# Altium project remote.PrjPCB (part 1 of 2)
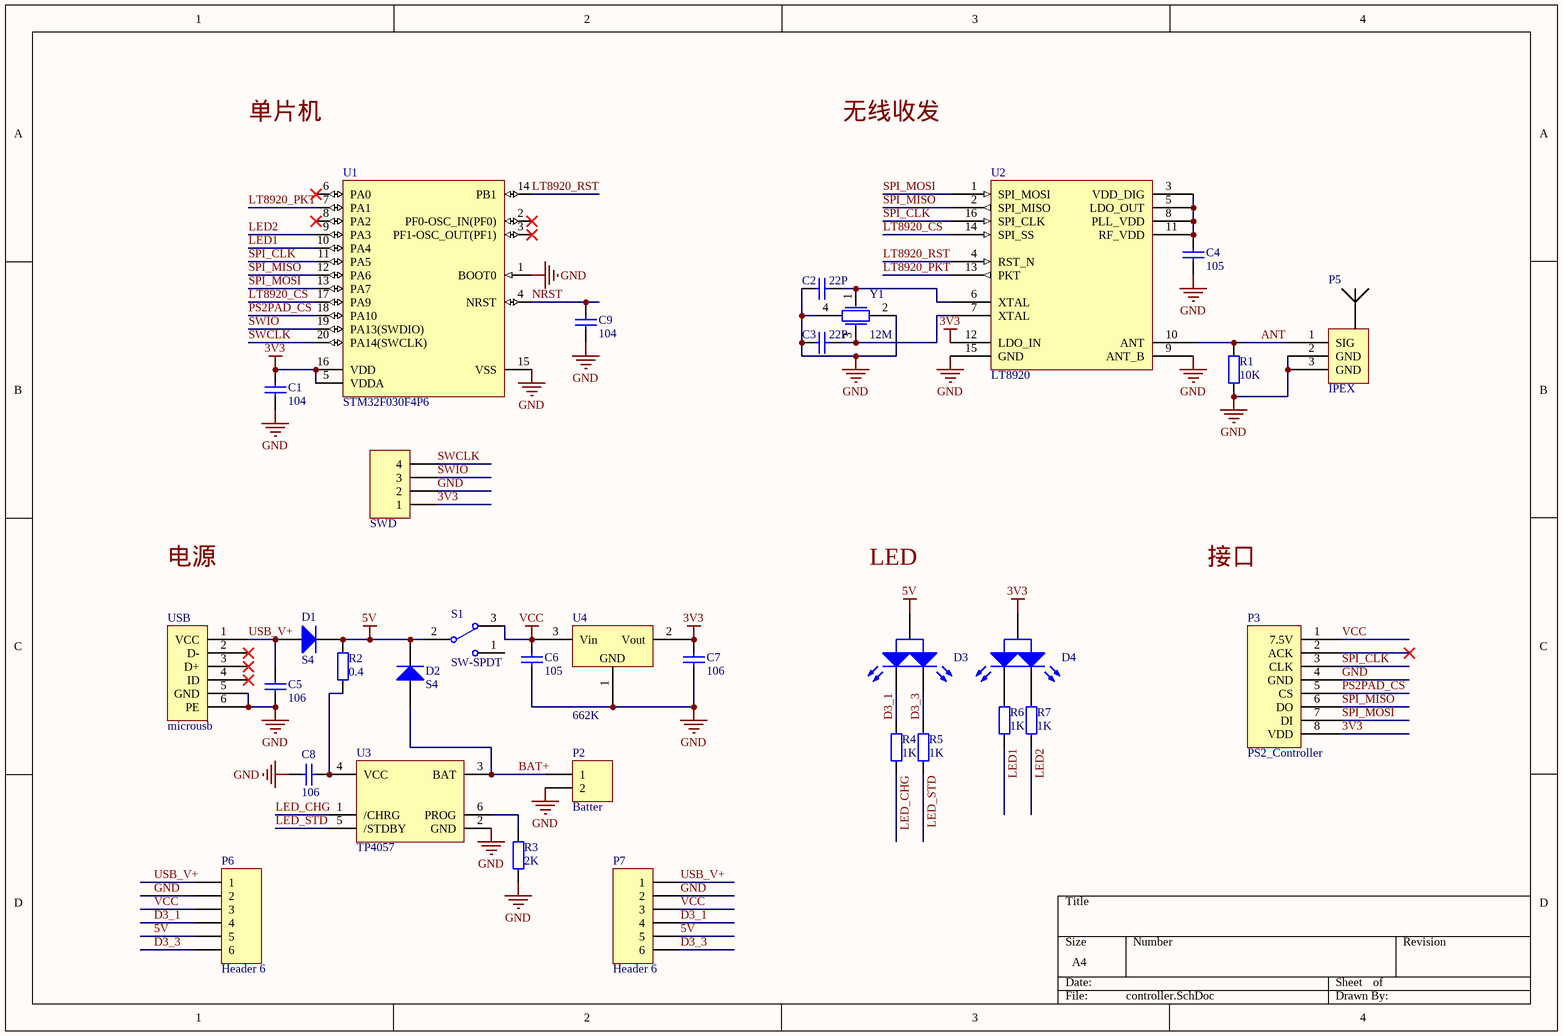
[diagram p0: controller.SchDoc]
9 sheets, 259 parts. Net scope: global (net labels, ports and power ports of the same name join across sheets).
Board files: controller.PcbDoc, controller_4layer.PcbDoc, receiver_plane_2S_A.PcbDoc, receiver_car_2S_A.PcbDoc
Sheets:
  controller.SchDoc
  controller-4layer.SchDoc
  controller_PA.SchDoc
  receiver_boat.SchDoc
  receiver_plane.SchDoc
  receiver_plane_2S.SchDoc
  receiver_car_2s.SchDoc
  receiver_car_1s.SchDoc
  receiver_car_2S_A.SchDoc

## Sheet controller.SchDoc
size A4

### Parts
(Parts that share a designator on the sheet are numbered #1, #2 ... from top to bottom, then left to right.)
C1#1  value 104  [0805-2]  (hidden comment: Cap)
C2#1  value 22P  [0805-2]  (hidden comment: Cap)
C3#1  value 22P  [0805-2]  (hidden comment: Cap)
C4#1  value 105  [0805-2]  (hidden comment: Cap)
C5#1  value 106  [0805-2]  (hidden comment: Cap)
C6#1  value 105  [0805-2]  (hidden comment: Cap)
C7#1  value 106  [0805-2]  (hidden comment: Cap)
C8#1  value 106  [0805-2]  (hidden comment: Cap)
C9#1  value 104  [0805-2]  (hidden comment: Cap)
D1#1  S4  [SOD523]
D2#1  S4  [SOD523]
D3#1  LED1  [HDR3X1_A]  (value not drawn)
D4#1  LED1  [HDR3X1_A]  (value not drawn)
P2#1  Batter  [HDR1X2]
P3#1  PS2_Controller  [HDR8X1_A]
P5#1  IPEX  [U.FL-R-SMT]
P6#1  Header 6  [HDR6*1*1.27]
P7#1  Header 6  [HDR6*1*1.27]
R1#1  value 10K  [0805-2]  (hidden comment: Res1)
R2#1  value 0.4  [1210]  (hidden comment: Res1)
R3#1  value 2K  [0805-2]  (hidden comment: Res1)
R4#1  value 1K  [0805-2]  (hidden comment: Res1)
R5#1  value 1K  [0805-2]  (hidden comment: Res1)
R6#1  value 1K  [0805-2]  (hidden comment: Res1)
R7#1  value 1K  [0805-2]  (hidden comment: Res1)
S1  SW-SPDT  [SWITCH_A4]
SWD#1  Header 4  [HDR4X1X1.27]  (value not drawn)
U1#1  STM32F030F4P6  [STM-TSSOP20_N]
U2#1  LT8920  [SSOP-16 LT8920]
U3#1  TP4057  [SOT23-6]
U4#1  662K  [SOT-23]
USB#1  microusb  [MICROUSB_1]
Y1#1  12M  [XTAL_3225]

### Nets
3V3: C1#1.1 C7#1.1 D4#1.2(A) P3#1.8(VDD) SWD#1.1 U1#1.5(VDDA) U1#1.16(VDD) U2#1.12(LDO_IN) U4#1.2(Vout)
5V: D1#1.2(K) D2#1.2(K) D3#1.2(A) P6#1.5 P7#1.5 R2#1.2 S1.2
BAT+: D2#1.1(A) P2#1.1 U3#1.3(BAT)
GND: C1#1.2 C2#1.1 C3#1.1 C4#1.1 C5#1.2 C6#1.2 C7#1.2 C8#1.2 C9#1.2 P2#1.2 P3#1.4(GND) P5#1.2(GND) P5#1.3(GND) P6#1.2 P7#1.2 R1#1.1 R3#1.1 SWD#1.2 U1#1.1(BOOT0) U1#1.15(VSS) U2#1.9(ANT_B) U2#1.15(GND) U3#1.2(GND) U4#1.1(Vss) USB#1.5(GND) USB#1.6(PE) Y1#1.2 Y1#1.4
VCC: C6#1.1 P3#1.1(7.5V) P6#1.3 P7#1.3 S1.3 U4#1.3(Vin)
ANT: P5#1.1(SIG) R1#1.2 U2#1.10(ANT)
D3_1: D3#1.3(K2) P6#1.4 P7#1.4 R4#1.2
D3_3: D3#1.1(K1) P6#1.6 P7#1.6 R5#1.2
LED1: R6#1.1 U1#1.10(PA4)
LED2: R7#1.1 U1#1.9(PA3)
LED_CHG: R4#1.1 U3#1.1(/CHRG)
LED_STD: R5#1.1 U3#1.5(/STDBY)
LT8920_CS: U1#1.17(PA9) U2#1.14(SPI_SS)
LT8920_PKT: U1#1.7(PA1) U2#1.13(PKT)
LT8920_RST: U1#1.14(PB1) U2#1.4(RST_N)
NRST: C9#1.1 U1#1.4(NRST)
PS2PAD_CS: P3#1.5(CS) U1#1.18(PA10)
SPI_CLK: P3#1.3(CLK) U1#1.11(PA5) U2#1.16(SPI_CLK)
SPI_MISO: P3#1.6(DO) U1#1.12(PA6) U2#1.2(SPI_MISO)
SPI_MOSI: P3#1.7(DI) U1#1.13(PA7) U2#1.1(SPI_MOSI)
SWCLK: SWD#1.4 U1#1.20(PA14(SWCLK))
SWIO: SWD#1.3 U1#1.19(PA13(SWDIO))
USB_V+: C5#1.1 D1#1.1(A) P6#1.1 P7#1.1 USB#1.1(VCC)
NetC2#1_2: C2#1.2 U2#1.6(XTAL) Y1#1.1
NetC3#1_2: C3#1.2 U2#1.7(XTAL) Y1#1.3
NetC4#1_2: C4#1.2 U2#1.3(VDD_DIG) U2#1.5(LDO_OUT) U2#1.8(PLL_VDD) U2#1.11(RF_VDD)
NetC8#1_1: C8#1.1 R2#1.1 U3#1.4(VCC)
NetD4#1_1: D4#1.1(K1) R7#1.2
NetD4#1_3: D4#1.3(K2) R6#1.2
NetR3#1_2: R3#1.2 U3#1.6(PROG)

Not connected (* = marked no-connect by the designer): P3#1 2(ACK)*; S1 1; U1#1 2(PF0-OSC_IN(PF0))* 3(PF1-OSC_OUT(PF1))* 6(PA0)* 8(PA2)*; USB#1 2(D-)* 3(D+)* 4(ID)*

### Notes on the sheet
- 单片机
- 无线收发
- 电源
- LED
- 接口
- (in symbol 662K) GND

### Library data of the parts
C1#1 C2#1 C3#1 C4#1 C5#1 C6#1 C7#1 C8#1 C9#1 = Cap: 无极性电容; Published: 8-Jun-2000; LatestRevisionDate: 17-Jul-2002; LatestRevisionNote: Re-released for DXP Platform.; PackageReference: RAD-0.3; Publisher: Altium Limited
D1#1 D2#1 = Diode: Default Diode; Published: 8-Jun-2000; LatestRevisionDate: 17-Jul-2002; LatestRevisionNote: Re-released for DXP Platform.; PackageVersion: Sep-1996; PackageReference: SMC; Publisher: Altium Limited; PackageDescription: DO-214-AB/SMC; 2 C-Bend Leads; Body 7.9 x 5.9 mm, inc. leads (LxW); Code_JEDEC: DO-214-AB
D3#1 D4#1 = LED1: 双色LED; Published: 8-Jun-2000; LatestRevisionDate: 08-Jul-2005; LatestRevisionNote: Mech Layer 1 removed.; PackageReference: LED-0; Publisher: Altium Limited
P2#1 = Header 2: Header, 2-Pin; LatestRevisionDate: 17-Jul-2002; LatestRevisionNote: Re-released for DXP Platform.; Publisher: Altium Limited
P5#1 = IPEX: U.FL-R-SMT
P6#1 P7#1 = Header 6: 接插件; LatestRevisionDate: 17-Jul-2002; LatestRevisionNote: Re-released for DXP Platform.; Publisher: Altium Limited
R1#1 R2#1 R3#1 R4#1 R5#1 R6#1 R7#1 = Res1: 贴片电阻; Published: 8-Jun-2000; LatestRevisionDate: 17-Jul-2002; LatestRevisionNote: Re-released for DXP Platform.; PackageReference: AXIAL-0.4; Publisher: Altium Limited
S1 = SW-SPDT: 开关; Published: 24-Mar-1999; LatestRevisionDate: 17-Dec-2003; LatestRevisionNote: Schematic revised, PCB Footprint replaced.; DatasheetDocument: 05-Dec-2000; PackageReference: TL36WW15050; Publisher: Altium Limited; ComponentLink1Description: Manufacturer Link; ComponentLink1URL: http://www.apem.com
SWD#1 = Header 4: 接插件; LatestRevisionDate: 17-Jul-2002; LatestRevisionNote: Re-released for DXP Platform.; Publisher: Altium Limited
U1#1 = STM32F030F4P6: ARM Cortex-M0 32-bit MCU, 16 KB Flash, 4 KB Internal RAM, 15 I/Os, 20-pin TSSOP, -40 to 85 degC, Tube; FLASH Size (Prog) (kB): 16; I/Os (High Current): 15; Internal RAM Size (kB): 4; Operating Frequency(F) (Processor speed) (MHz): 48; Supply Voltage(Vcc) min (V): 2.4; DatasheetVersion: Rev. 1; PackageVersion: Rev. 1, 11/2012; PackageReference: TSSOP20; PackageDescription: 20-Pin Thin Shrink Small Outline Package, 6.5 x 4.4 mm Body, 0.65 mm Pitch; Supplier 1: Digi-Key; Supplier Part Number 1: 497-14044-5-ND; Supplier 2: Newark; Supplier Part Number 2: 06X3648; Supplier 3: Mouser; Supplier Part Number 3: 511-STM32F030F4P6; Core: ARM Cortex-M0; Packing: Tube; Mounting Technology: Surface Mount; PartNumber: STM32F030F4P6; ComponentLink1Description: Manufacturer URL; ComponentLink1URL: http://www.st.com/web/en/home.html; ComponentLink2Description: Datasheet; ComponentLink2URL: http://www.st.com/st-web-ui/static/active/en/resource/technical/document/datasheet/DM00088500.pdf; ComponentLink3Description: Package Specification; ComponentLink3URL: http://www.st.com/st-web-ui/static/active/en/resource/technical/document/datasheet/DM00065136.pdf
U3#1 = TP4057: l锂电池管理芯片
Y1#1 = XTAL-4PIN: 贴片晶振

## Sheet controller-4layer.SchDoc
size A4
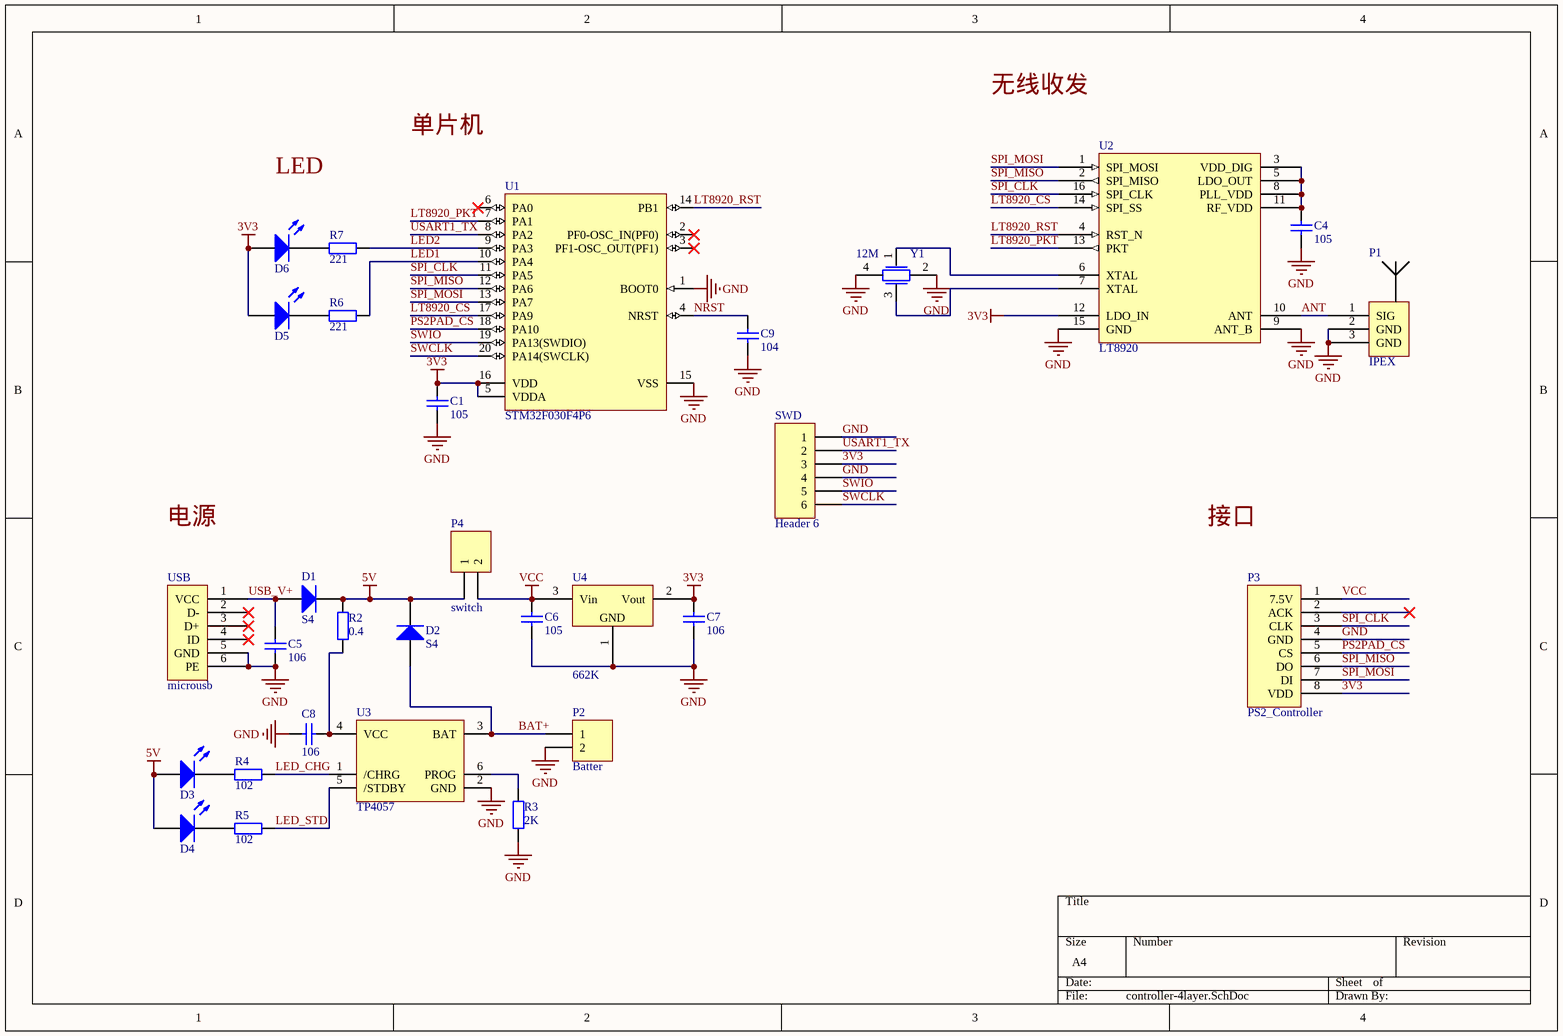
[diagram p1: controller-4layer.SchDoc]

### Parts
(Parts that share a designator on the sheet are numbered #1, #2 ... from top to bottom, then left to right.)
C1#2  value 105  [0805-2]  (hidden comment: Cap)
C4#2  value 105  [0805-2]  (hidden comment: Cap)
C5#2  value 106  [0805-2]  (hidden comment: Cap)
C6#2  value 105  [0805-2]  (hidden comment: Cap)
C7#2  value 106  [0805-2]  (hidden comment: Cap)
C8#2  value 106  [0805-2]  (hidden comment: Cap)
C9#2  value 104  [0805-2]  (hidden comment: Cap)
D1#2  S4  [SOD523]
D2#2  S4  [SOD523]
D3#2  LED0  [LED_0805]  (value not drawn)
D4#2  LED0  [LED_0805]  (value not drawn)
D5#1  LED0  [LED_0805]  (value not drawn)
D6#1  LED0  [LED_0805]  (value not drawn)
P1#1  IPEX  [U.FL-R-SMT]
P2#2  Batter  [HDR1X2]
P3#2  PS2_Controller  [HDR8X1_A]
P4#1  switch  [HDR1X2]
R2#2  value 0.4  [1210]  (hidden comment: Res1)
R3#2  value 2K  [0805-2]  (hidden comment: Res1)
R4#2  value 102  [0805-2]  (hidden comment: Res1)
R5#2  value 102  [0805-2]  (hidden comment: Res1)
R6#2  value 221  [0805-2]  (hidden comment: Res1)
R7#2  value 221  [0805-2]  (hidden comment: Res1)
SWD#2  Header 6  [HDR6*1*1.27]
U1#2  STM32F030F4P6  [STM-TSSOP20_N]
U2#2  LT8920  [SSOP-16 LT8920]
U3#2  TP4057  [SOT23-6]
U4#2  662K  [SOT-23]
USB#2  microusb  [MICROUSB_1]
Y1#2  12M  [XTAL_3225]

### Nets
3V3: C1#2.1 C7#2.1 D5#1.1(A) D6#1.1(A) P3#2.8(VDD) SWD#2.3 U1#2.5(VDDA) U1#2.16(VDD) U2#2.12(LDO_IN) U4#2.2(Vout)
5V: D1#2.2(K) D2#2.2(K) D3#2.1(A) D4#2.1(A) P4#1.1 R2#2.2
BAT+: D2#2.1(A) P2#2.1 U3#2.3(BAT)
GND: C1#2.2 C4#2.1 C5#2.2 C6#2.2 C7#2.2 C8#2.2 C9#2.2 P1#1.2(GND) P1#1.3(GND) P2#2.2 P3#2.4(GND) R3#2.1 SWD#2.1 SWD#2.4 U1#2.1(BOOT0) U1#2.15(VSS) U2#2.9(ANT_B) U2#2.15(GND) U3#2.2(GND) U4#2.1(Vss) USB#2.5(GND) USB#2.6(PE) Y1#2.2 Y1#2.4
VCC: C6#2.1 P3#2.1(7.5V) P4#1.2 U4#2.3(Vin)
ANT: P1#1.1(SIG) U2#2.10(ANT)
LED1: R6#2.1 U1#2.10(PA4)
LED2: R7#2.1 U1#2.9(PA3)
LED_CHG: R4#2.1 U3#2.1(/CHRG)
LED_STD: R5#2.1 U3#2.5(/STDBY)
LT8920_CS: U1#2.17(PA9) U2#2.14(SPI_SS)
LT8920_PKT: U1#2.7(PA1) U2#2.13(PKT)
LT8920_RST: U1#2.14(PB1) U2#2.4(RST_N)
NRST: C9#2.1 U1#2.4(NRST)
PS2PAD_CS: P3#2.5(CS) U1#2.18(PA10)
SPI_CLK: P3#2.3(CLK) U1#2.11(PA5) U2#2.16(SPI_CLK)
SPI_MISO: P3#2.6(DO) U1#2.12(PA6) U2#2.2(SPI_MISO)
SPI_MOSI: P3#2.7(DI) U1#2.13(PA7) U2#2.1(SPI_MOSI)
SWCLK: SWD#2.6 U1#2.20(PA14(SWCLK))
SWIO: SWD#2.5 U1#2.19(PA13(SWDIO))
USART1_TX: SWD#2.2 U1#2.8(PA2)
USB_V+: C5#2.1 D1#2.1(A) USB#2.1(VCC)
NetC4#2_2: C4#2.2 U2#2.3(VDD_DIG) U2#2.5(LDO_OUT) U2#2.8(PLL_VDD) U2#2.11(RF_VDD)
NetC8#2_1: C8#2.1 R2#2.1 U3#2.4(VCC)
NetD3#2_2: D3#2.2(K) R4#2.2
NetD4#2_2: D4#2.2(K) R5#2.2
NetD5#1_2: D5#1.2(K) R6#2.2
NetD6#1_2: D6#1.2(K) R7#2.2
NetR3#2_2: R3#2.2 U3#2.6(PROG)
NetU2#2_6: U2#2.6(XTAL) Y1#2.1
NetU2#2_7: U2#2.7(XTAL) Y1#2.3

Not connected (* = marked no-connect by the designer): P3#2 2(ACK)*; U1#2 2(PF0-OSC_IN(PF0))* 3(PF1-OSC_OUT(PF1))* 6(PA0)*; USB#2 2(D-)* 3(D+)* 4(ID)*

### Notes on the sheet
- 无线收发
- LED
- 单片机
- 电源
- 接口
- (in symbol 662K) GND

### Library data of the parts
C1#2 C4#2 C5#2 C6#2 C7#2 C8#2 C9#2 = Cap: 无极性电容; Published: 8-Jun-2000; LatestRevisionDate: 17-Jul-2002; LatestRevisionNote: Re-released for DXP Platform.; PackageReference: RAD-0.3; Publisher: Altium Limited
D1#2 D2#2 = Diode: Default Diode; Published: 8-Jun-2000; LatestRevisionDate: 17-Jul-2002; LatestRevisionNote: Re-released for DXP Platform.; PackageVersion: Sep-1996; PackageReference: SMC; Publisher: Altium Limited; PackageDescription: DO-214-AB/SMC; 2 C-Bend Leads; Body 7.9 x 5.9 mm, inc. leads (LxW); Code_JEDEC: DO-214-AB
D3#2 D4#2 D5#1 D6#1 = LED0: 发光二极管; Published: 8-Jun-2000; LatestRevisionDate: 08-Jul-2005; LatestRevisionNote: Mech Layer 1 removed.; PackageReference: LED-0; Publisher: Altium Limited
P1#1 = IPEX: U.FL-R-SMT
P2#2 P4#1 = Header 2: Header, 2-Pin; LatestRevisionDate: 17-Jul-2002; LatestRevisionNote: Re-released for DXP Platform.; Publisher: Altium Limited
R2#2 R3#2 R4#2 R5#2 R6#2 R7#2 = Res1: 贴片电阻; Published: 8-Jun-2000; LatestRevisionDate: 17-Jul-2002; LatestRevisionNote: Re-released for DXP Platform.; PackageReference: AXIAL-0.4; Publisher: Altium Limited
SWD#2 = Header 6: 接插件; LatestRevisionDate: 17-Jul-2002; LatestRevisionNote: Re-released for DXP Platform.; Publisher: Altium Limited
U1#2 = STM32F030F4P6: as U1#1 on sheet controller; DatasheetVersion: Rev. 1; PackageVersion: Rev. 1, 11/2012; PackageReference: TSSOP20; PackageDescription: 20-Pin Thin Shrink Small Outline Package, 6.5 x 4.4 mm Body, 0.65 mm Pitch; Supplier 1: Digi-Key; Supplier Part Number 1: 497-14044-5-ND; Supplier 2: Newark; Supplier Part Number 2: 06X3648; Supplier 3: Mouser; Supplier Part Number 3: 511-STM32F030F4P6; Core: ARM Cortex-M0; Packing: Tube; Mounting Technology: Surface Mount; PartNumber: STM32F030F4P6; ComponentLink1Description: Manufacturer URL; ComponentLink1URL: http://www.st.com/web/en/home.html; ComponentLink2Description: Datasheet; ComponentLink2URL: http://www.st.com/st-web-ui/static/active/en/resource/technical/document/datasheet/DM00088500.pdf; ComponentLink3Description: Package Specification; ComponentLink3URL: http://www.st.com/st-web-ui/static/active/en/resource/technical/document/datasheet/DM00065136.pdf
U3#2 = TP4057: l锂电池管理芯片
Y1#2 = XTAL-4PIN: 贴片晶振

## Sheet controller_PA.SchDoc
size A4
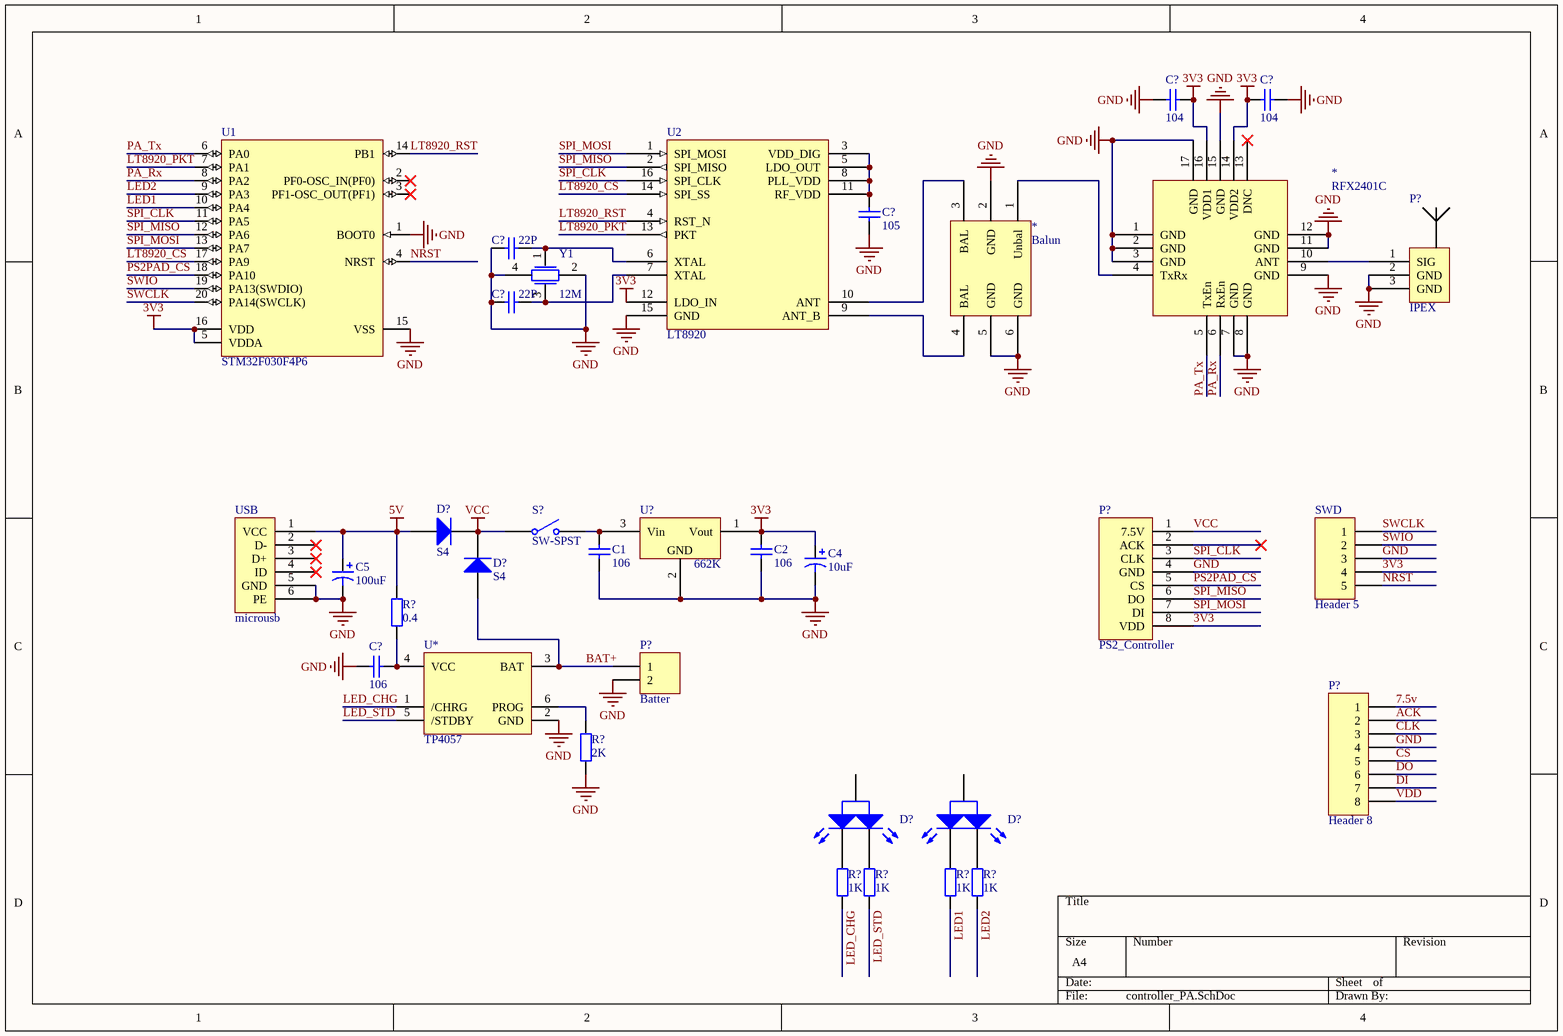
[diagram p2: controller_PA.SchDoc]

### Parts
(Parts that share a designator on the sheet are numbered #1, #2 ... from top to bottom, then left to right.)
*#1  RFX2401C  [QFN-16 - duplicate]
*#2  Balun  [Balun]
C1#3  106  [0805]
C2#2  106  [0805]
C4#3  10uF  [0805]
C5#3  100uF  [0805]
C?#1  value 104  [0805-2]  (hidden comment: Cap)
C?#2  value 104  [0805-2]  (hidden comment: Cap)
C?#3  value 105  [0805-2]  (hidden comment: Cap)
C?#4  value 22P  [0805-2]  (hidden comment: Cap)
C?#5  value 22P  [0805-2]  (hidden comment: Cap)
C?#6  value 106  [0805-2]  (hidden comment: Cap)
D?#1  S4  [SOD523]
D?#2  S4  [SOD523]
D?#3  LED1  [LED_A3]  (value not drawn)
D?#4  LED1  [LED_A3]  (value not drawn)
P?#1  IPEX  [U.FL-R-SMT]
P?#2  PS2_Controller  [HDR8X1_A]
P?#3  Batter  [HDR1X2]
P?#4  Header 8  [HDR1X8]
R?#1  value 0.4  [1210]  (hidden comment: Res1)
R?#2  value 2K  [0603-1]  (hidden comment: Res1)
R?#3  value 1K  [0603-1]  (hidden comment: Res1)
R?#4  value 1K  [0603-1]  (hidden comment: Res1)
R?#5  value 1K  [0603-1]  (hidden comment: Res1)
R?#6  value 1K  [0603-1]  (hidden comment: Res1)
S?  SW-SPST  [SPST-2]
SWD#3  Header 5  [HDR5*1*1.27]
U1#3  STM32F030F4P6  [STM-TSSOP20_N]
U2#3  LT8920
U*  TP4057  [SOT23-6]
U?#1  662K  [SOT-23]
USB#3  microusb  [MICROUSB_1]
Y1#3  12M  [XTAL_3225]

### Nets
3V3: *#1.14(VDD2) *#1.16(VDD1) C2#2.2 C4#3.1 C?#1.1 C?#2.2 P?#2.8(VDD) SWD#3.4 U1#3.5(VDDA) U1#3.16(VDD) U2#3.12(LDO_IN) U?#1.1(Vout)
5V: C5#3.1 D?#1.1(A) R?#1.2 USB#3.1(VCC)
BAT+: D?#2.1(A) P?#3.1 U*.3(BAT)
GND: *#1.1(GND) *#1.2(GND) *#1.3(GND) *#1.7(GND) *#1.8(GND) *#1.9(GND) *#1.11(GND) *#1.12(GND) *#1.15(GND) *#1.17(GND) *#2.2(GND) *#2.5(GND) *#2.6(GND) C1#3.1 C2#2.1 C4#3.2 C5#3.2 C?#1.2 C?#2.1 C?#3.1 C?#4.1 C?#5.1 C?#6.2 P?#1.2(GND) P?#1.3(GND) P?#2.4(GND) P?#3.2 P?#4.4 R?#2.1 SWD#3.3 U1#3.1(BOOT0) U1#3.15(VSS) U2#3.15(GND) U*.2(GND) U?#1.2(Vss) USB#3.5(GND) USB#3.6(PE) Y1#3.2 Y1#3.4
VCC: D?#1.2(K) D?#2.2(K) P?#2.1(7.5V) S?.1(COMMON)
7.5v: P?#4.1
ACK: P?#4.2
CLK: P?#4.3
CS: P?#4.5
DI: P?#4.7
DO: P?#4.6
LED1: R?#5.1 U1#3.10(PA4)
LED2: R?#6.1 U1#3.9(PA3)
LED_CHG: R?#3.1 U*.1(/CHRG)
LED_STD: R?#4.1 U*.5(/STDBY)
LT8920_CS: U1#3.17(PA9) U2#3.14(SPI_SS)
LT8920_PKT: U1#3.7(PA1) U2#3.13(PKT)
LT8920_RST: U1#3.14(PB1) U2#3.4(RST_N)
NRST: SWD#3.5 U1#3.4(NRST)
PA_Rx: *#1.6(RxEn) U1#3.8(PA2)
PA_Tx: *#1.5(TxEn) U1#3.6(PA0)
PS2PAD_CS: P?#2.5(CS) U1#3.18(PA10)
SPI_CLK: P?#2.3(CLK) U1#3.11(PA5) U2#3.16(SPI_CLK)
SPI_MISO: P?#2.6(DO) U1#3.12(PA6) U2#3.2(SPI_MISO)
SPI_MOSI: P?#2.7(DI) U1#3.13(PA7) U2#3.1(SPI_MOSI)
SWCLK: SWD#3.1 U1#3.20(PA14(SWCLK))
SWIO: SWD#3.2 U1#3.19(PA13(SWDIO))
VDD: P?#4.8
Net*#1_4: *#1.4(TxRx) *#2.1(Unbal)
Net*#1_10: *#1.10(ANT) P?#1.1(SIG)
Net*#2_3: *#2.3(BAL) U2#3.10(ANT)
Net*#2_4: *#2.4(BAL) U2#3.9(ANT_B)
NetC1#3_2: C1#3.2 S?.2(NO) U?#1.3(Vin)
NetC?#3_2: C?#3.2 U2#3.3(VDD_DIG) U2#3.5(LDO_OUT) U2#3.8(PLL_VDD) U2#3.11(RF_VDD)
NetC?#4_2: C?#4.2 U2#3.6(XTAL) Y1#3.1
NetC?#5_2: C?#5.2 U2#3.7(XTAL) Y1#3.3
NetC?#6_1: C?#6.1 R?#1.1 U*.4(VCC)
NetD?#3_1: D?#3.1(K1) R?#4.2
NetD?#3_3: D?#3.3(K2) R?#3.2
NetD?#4_1: D?#4.1(K1) R?#6.2
NetD?#4_3: D?#4.3(K2) R?#5.2
NetR?#2_2: R?#2.2 U*.6(PROG)

Not connected (* = marked no-connect by the designer): *#1 13(DNC)*; D?#3 2(A); D?#4 2(A); P?#2 2(ACK)*; U1#3 2(PF0-OSC_IN(PF0))* 3(PF1-OSC_OUT(PF1))*; USB#3 2(D-)* 3(D+)* 4(ID)*

### Notes on the sheet
- (in symbol 662K) GND

### Library data of the parts
*#2 = Balun: 2450BM15A0002
C1#3 C2#2 = Cap Semi: Capacitor (Semiconductor SIM Model); Published: 8-Jun-2000; LatestRevisionDate: 29-May-2009; LatestRevisionNote: IPC-7351 Footprint Added.; PackageReference: C1206; Publisher: Altium Limited; PackageDescription: Chip Capacitor; Value: 106
C4#3 C5#3 = Cap Pol3: Polarized Capacitor (Surface Mount); Value: 100pF; Published: 8-Jun-2000; LatestRevisionDate: 29-May-2009; LatestRevisionNote: IPC-7351 Footprint Added.; PackageReference: C0805; Publisher: Altium Limited; PackageDescription: Chip Capacitor
C?#1-C?#6 = Cap: 无极性电容; Published: 8-Jun-2000; LatestRevisionDate: 17-Jul-2002; LatestRevisionNote: Re-released for DXP Platform.; PackageReference: RAD-0.3; Publisher: Altium Limited
D?#1 D?#2 = Diode: Default Diode; Published: 8-Jun-2000; LatestRevisionDate: 17-Jul-2002; LatestRevisionNote: Re-released for DXP Platform.; PackageVersion: Sep-1996; PackageReference: SMC; Publisher: Altium Limited; PackageDescription: DO-214-AB/SMC; 2 C-Bend Leads; Body 7.9 x 5.9 mm, inc. leads (LxW); Code_JEDEC: DO-214-AB
D?#3 D?#4 = LED1: 双色LED; Published: 8-Jun-2000; LatestRevisionDate: 08-Jul-2005; LatestRevisionNote: Mech Layer 1 removed.; PackageReference: LED-0; Publisher: Altium Limited
P?#1 = IPEX: U.FL-R-SMT
P?#3 = Header 2: Header, 2-Pin; LatestRevisionDate: 17-Jul-2002; LatestRevisionNote: Re-released for DXP Platform.; Publisher: Altium Limited
P?#4 = Header 8: Header, 8-Pin; LatestRevisionDate: 17-Jul-2002; LatestRevisionNote: Re-released for DXP Platform.; Publisher: Altium Limited
R?#1-R?#6 = Res1: 贴片电阻; Published: 8-Jun-2000; LatestRevisionDate: 17-Jul-2002; LatestRevisionNote: Re-released for DXP Platform.; PackageReference: AXIAL-0.4; Publisher: Altium Limited
S? = SW-SPST: Single-Pole, Single-Throw Switch; Published: 24-Mar-1999; LatestRevisionDate: 17-Jul-2002; LatestRevisionNote: Re-released for DXP Platform.; PackageReference: SPST-2; Publisher: Altium Limited; PackageDescription: Switch; 2 Leads
SWD#3 = Header 5: 接插件
U1#3 = STM32F030F4P6: as U1#1 on sheet controller; DatasheetVersion: Rev. 1; PackageVersion: Rev. 1, 11/2012; PackageReference: TSSOP20; PackageDescription: 20-Pin Thin Shrink Small Outline Package, 6.5 x 4.4 mm Body, 0.65 mm Pitch; Supplier 1: Digi-Key; Supplier Part Number 1: 497-14044-5-ND; Supplier 2: Newark; Supplier Part Number 2: 06X3648; Supplier 3: Mouser; Supplier Part Number 3: 511-STM32F030F4P6; Core: ARM Cortex-M0; Packing: Tube; Mounting Technology: Surface Mount; PartNumber: STM32F030F4P6; ComponentLink1Description: Manufacturer URL; ComponentLink1URL: http://www.st.com/web/en/home.html; ComponentLink2Description: Datasheet; ComponentLink2URL: http://www.st.com/st-web-ui/static/active/en/resource/technical/document/datasheet/DM00088500.pdf; ComponentLink3Description: Package Specification; ComponentLink3URL: http://www.st.com/st-web-ui/static/active/en/resource/technical/document/datasheet/DM00065136.pdf
U* = TP4057: l锂电池管理芯片
Y1#3 = XTAL-4PIN: 贴片晶振

## Sheet receiver_boat.SchDoc
size A4

## Sheet receiver_plane.SchDoc
size A3
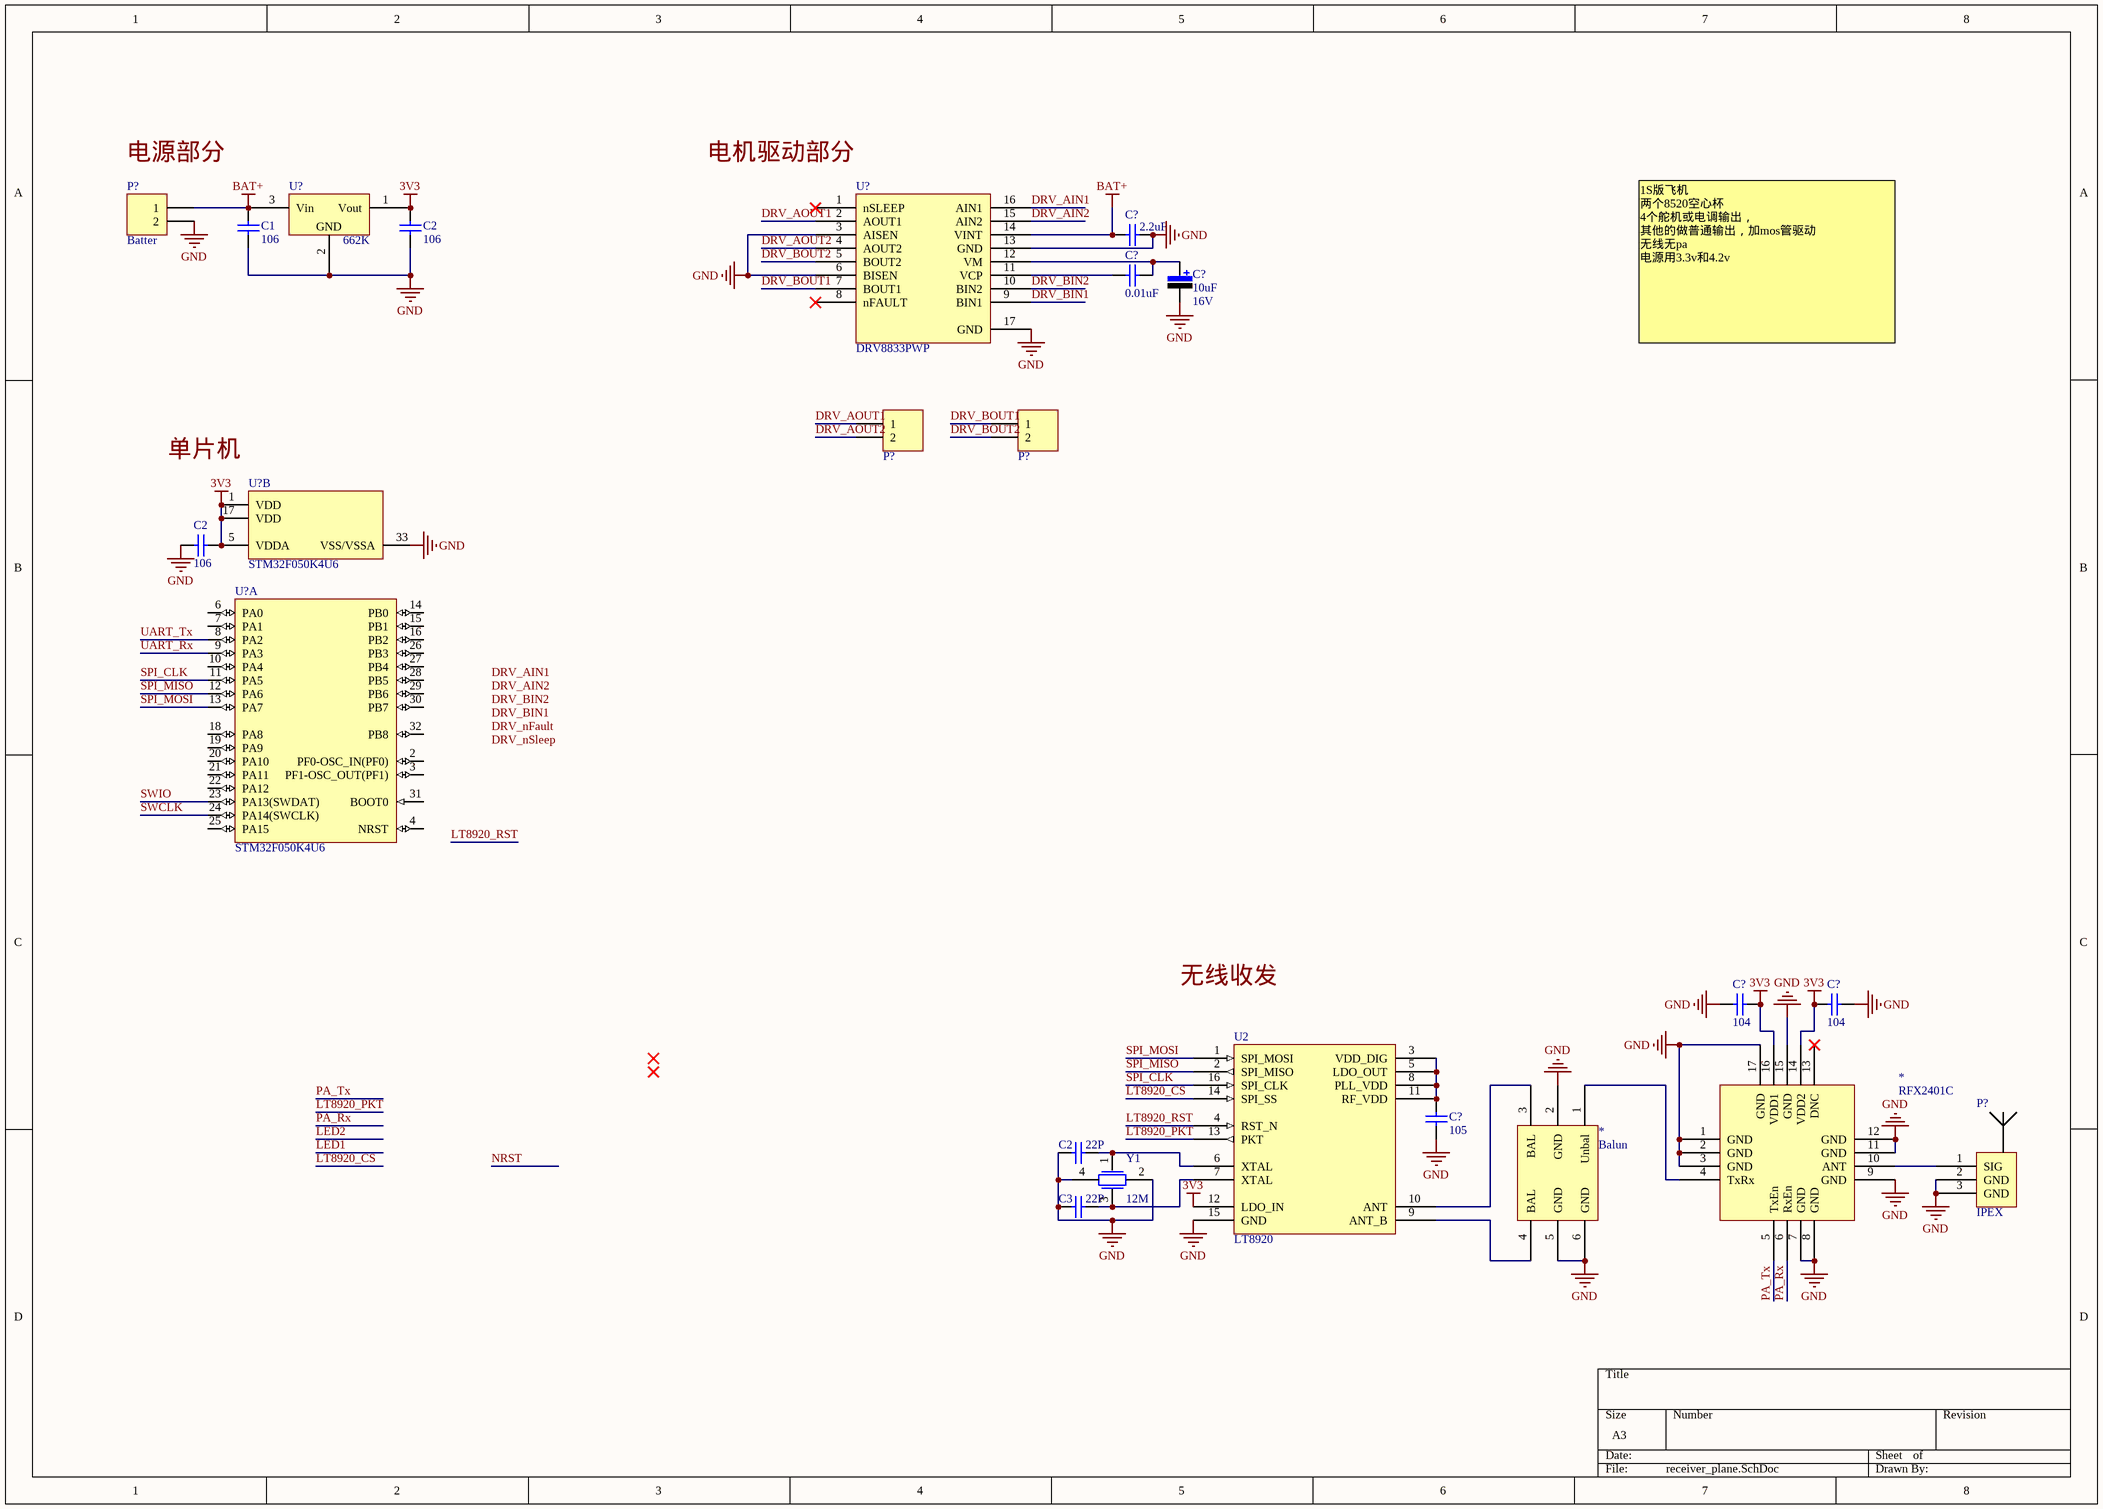
[diagram p3: receiver_plane.SchDoc]

### Parts
(Parts that share a designator on the sheet are numbered #1, #2 ... from top to bottom, then left to right.)
*#3  RFX2401C  [QFN-16 - duplicate]
*#4  Balun  [Balun]
C1#4  106  [0805]
C2#3  106  [0805]
C2#4  106  [0805]
C2#5  value 22P  [0805-2]  (hidden comment: Cap)
C3#2  value 22P  [0805-2]  (hidden comment: Cap)
C?#7  value 2.2uF  [0805-2]  (hidden comment: Cap)
C?#8  value 0.01uF  [0805-2]  (hidden comment: Cap)
C?#9  value 10uF  Vol: 16V  [C-RB-8]  (hidden comment: Cap Pol)
C?#10  value 104  [0805-2]  (hidden comment: Cap)
C?#11  value 104  [0805-2]  (hidden comment: Cap)
C?#12  value 105  [0805-2]  (hidden comment: Cap)
P?#5  Batter  [HDR1X2]
P?#6  Header 2  [HDR2X1_A]  (value not drawn)
P?#7  Header 2  [HDR2X1_A]  (value not drawn)
P?#8  IPEX  [U.FL-R-SMT]
U2#4  LT8920
U?#2  DRV8833PWP  [HTSSOP-16 DRV8833]
U?#3  662K  [SOT-23]
U?#4  STM32F050K4U6  [STM-UFQFPN32_N]  (part B of 2)
U?#5  STM32F050K4U6  [STM-UFQFPN32_N]  (part A of 2)
Y1#4  12M  [XTAL_3225]

### Nets
3V3: *#3.14(VDD2) *#3.16(VDD1) C2#3.2 C2#4.1 C?#10.1 C?#11.2 U2#4.12(LDO_IN) U?#3.1(Vout) U?#4.1(VDD) U?#4.5(VDDA) U?#4.17(VDD)
BAT+: C1#4.2 C?#7.2 P?#5.1 U?#2.14(VINT) U?#3.3(Vin)
GND: *#3.1(GND) *#3.2(GND) *#3.3(GND) *#3.7(GND) *#3.8(GND) *#3.9(GND) *#3.11(GND) *#3.12(GND) *#3.15(GND) *#3.17(GND) *#4.2(GND) *#4.5(GND) *#4.6(GND) C1#4.1 C2#3.1 C2#4.2 C2#5.1 C3#2.1 C?#7.1 C?#9.2 C?#10.2 C?#11.1 C?#12.1 P?#5.2 P?#8.2(GND) P?#8.3(GND) U2#4.15(GND) U?#2.3(AISEN) U?#2.6(BISEN) U?#2.13(GND) U?#2.17(GND) U?#3.2(Vss) U?#4.33(VSS/VSSA) Y1#4.2 Y1#4.4
DRV_AIN1: U?#2.16(AIN1)
DRV_AIN2: U?#2.15(AIN2)
DRV_AOUT1: P?#6.1 U?#2.2(AOUT1)
DRV_AOUT2: P?#6.2 U?#2.4(AOUT2)
DRV_BIN1: U?#2.9(BIN1)
DRV_BIN2: U?#2.10(BIN2)
DRV_BOUT1: P?#7.1 U?#2.7(BOUT1)
DRV_BOUT2: P?#7.2 U?#2.5(BOUT2)
LT8920_CS: U2#4.14(SPI_SS)
LT8920_PKT: U2#4.13(PKT)
LT8920_RST: U2#4.4(RST_N)
PA_Rx: *#3.6(RxEn)
PA_Tx: *#3.5(TxEn)
SPI_CLK: U2#4.16(SPI_CLK) U?#5.11(PA5)
SPI_MISO: U2#4.2(SPI_MISO) U?#5.12(PA6)
SPI_MOSI: U2#4.1(SPI_MOSI) U?#5.13(PA7)
SWCLK: U?#5.24(PA14(SWCLK))
SWIO: U?#5.23(PA13(SWDAT))
UART_Rx: U?#5.9(PA3)
UART_Tx: U?#5.8(PA2)
Net*#3_4: *#3.4(TxRx) *#4.1(Unbal)
Net*#3_10: *#3.10(ANT) P?#8.1(SIG)
Net*#4_3: *#4.3(BAL) U2#4.10(ANT)
Net*#4_4: *#4.4(BAL) U2#4.9(ANT_B)
NetC2#5_2: C2#5.2 U2#4.6(XTAL) Y1#4.1
NetC3#2_2: C3#2.2 U2#4.7(XTAL) Y1#4.3
NetC?#8_1: C?#8.1 C?#9.1 U?#2.12(VM)
NetC?#8_2: C?#8.2 U?#2.11(VCP)
NetC?#12_2: C?#12.2 U2#4.3(VDD_DIG) U2#4.5(LDO_OUT) U2#4.8(PLL_VDD) U2#4.11(RF_VDD)

Not connected (* = marked no-connect by the designer): *#3 13(DNC)*; U?#2 1(nSLEEP)* 8(nFAULT)*; U?#5 2(PF0-OSC_IN(PF0)) 3(PF1-OSC_OUT(PF1)) 4(NRST) 6(PA0) 7(PA1) 10(PA4) 14(PB0) 15(PB1) 16(PB2) 18(PA8) 19(PA9) 20(PA10) 21(PA11) 22(PA12) 25(PA15) 26(PB3) 27(PB4) 28(PB5) 29(PB6) 30(PB7) 31(BOOT0) 32(PB8)

### Notes on the sheet
- (near P?#5) 电源部分
- 电机驱动部分
- 1S版飞机
  两个8520空心杯
  4个舵机或电调输出，
  其他的做普通输出，加mos管驱动
  无线无pa
  电源用3.3v和4.2v
- 单片机
- 无线收发
- Labels drawn without touching a wire or pin: DRV_AIN1, DRV_AIN2, DRV_BIN1, DRV_BIN2, DRV_nFault, DRV_nSleep
- (in symbol 662K) GND

### Library data of the parts
*#4 = Balun: 2450BM15A0002
C1#4 C2#3 C2#4 = Cap Semi: Capacitor (Semiconductor SIM Model); Published: 8-Jun-2000; LatestRevisionDate: 29-May-2009; LatestRevisionNote: IPC-7351 Footprint Added.; PackageReference: C1206; Publisher: Altium Limited; PackageDescription: Chip Capacitor; Value: 106
C2#5 C3#2 C?#7 C?#8 C?#10-C?#12 = Cap: 无极性电容; Published: 8-Jun-2000; LatestRevisionDate: 17-Jul-2002; LatestRevisionNote: Re-released for DXP Platform.; PackageReference: RAD-0.3; Publisher: Altium Limited
C?#9 = Cap Pol: 极性电解电容; Published: 8-Jun-2000; LatestRevisionDate: 17-Jul-2002; LatestRevisionNote: Re-released for DXP Platform.; PackageReference: RB7.6-15; Publisher: Altium Limited
P?#5 = Header 2: Header, 2-Pin; LatestRevisionDate: 17-Jul-2002; LatestRevisionNote: Re-released for DXP Platform.; Publisher: Altium Limited
P?#6 P?#7 = Header 2: 接插件; LatestRevisionDate: 17-Jul-2002; LatestRevisionNote: Re-released for DXP Platform.; Publisher: Altium Limited
P?#8 = IPEX: U.FL-R-SMT
U?#2 = DRV8833PWP: DRV8833_HTSSOP封装
U?#4 U?#5 = STM32F050K4U6: ARM Cortex-M0 32-bit MCU, 16 KB Flash, 4 KB Internal RAM, 27 I/Os, 32-pin UFQFPN, -40 to 85 degC, Tray; FLASH Size (Prog) (kB): 16; I/Os (High Current): 27; Internal RAM Size (kB): 4; Operating Frequency(F) (Processor speed) (MHz): 48; Supply Voltage(Vcc) min (V): 2; DatasheetVersion: Rev. 1; PackageVersion: Rev. 3, 07/2012; PackageReference: UFQFPN32; PackageDescription: 32-Pin Ultra Thin Fine Pitch Quad Flat No-Lead, 5 x 5 x 0.6 mm Body, 0.5 mm Pitch, Exposed Pad; Supplier 1: Digi-Key; Supplier Part Number 1: 497-13621-ND; Supplier 2: Farnell; Supplier Part Number 2: 2333139; Supplier 3: Newark; Supplier Part Number 3: 99W9752; Supplier 4: Newark; Supplier Part Number 4: 48W6864; Supplier 5: Mouser; Supplier Part Number 5: 511-STM32F050K4U6; Core: ARM Cortex-M0; Packing: Tray; Mounting Technology: Surface Mount; PartNumber: STM32F050K4U6; ComponentLink1Description: Manufacturer URL; ComponentLink1URL: http://www.st.com/web/en/home.html; ComponentLink2Description: Datasheet; ComponentLink2URL: http://www.st.com/st-web-ui/static/active/en/resource/technical/document/datasheet/DM00065136.pdf; ComponentLink3Description: Package Specification; ComponentLink3URL: http://www.st.com/st-web-ui/static/active/en/resource/technical/document/datasheet/DM00039193.pdf
Y1#4 = XTAL-4PIN: 贴片晶振

## Sheet receiver_plane_2S.SchDoc
size A3
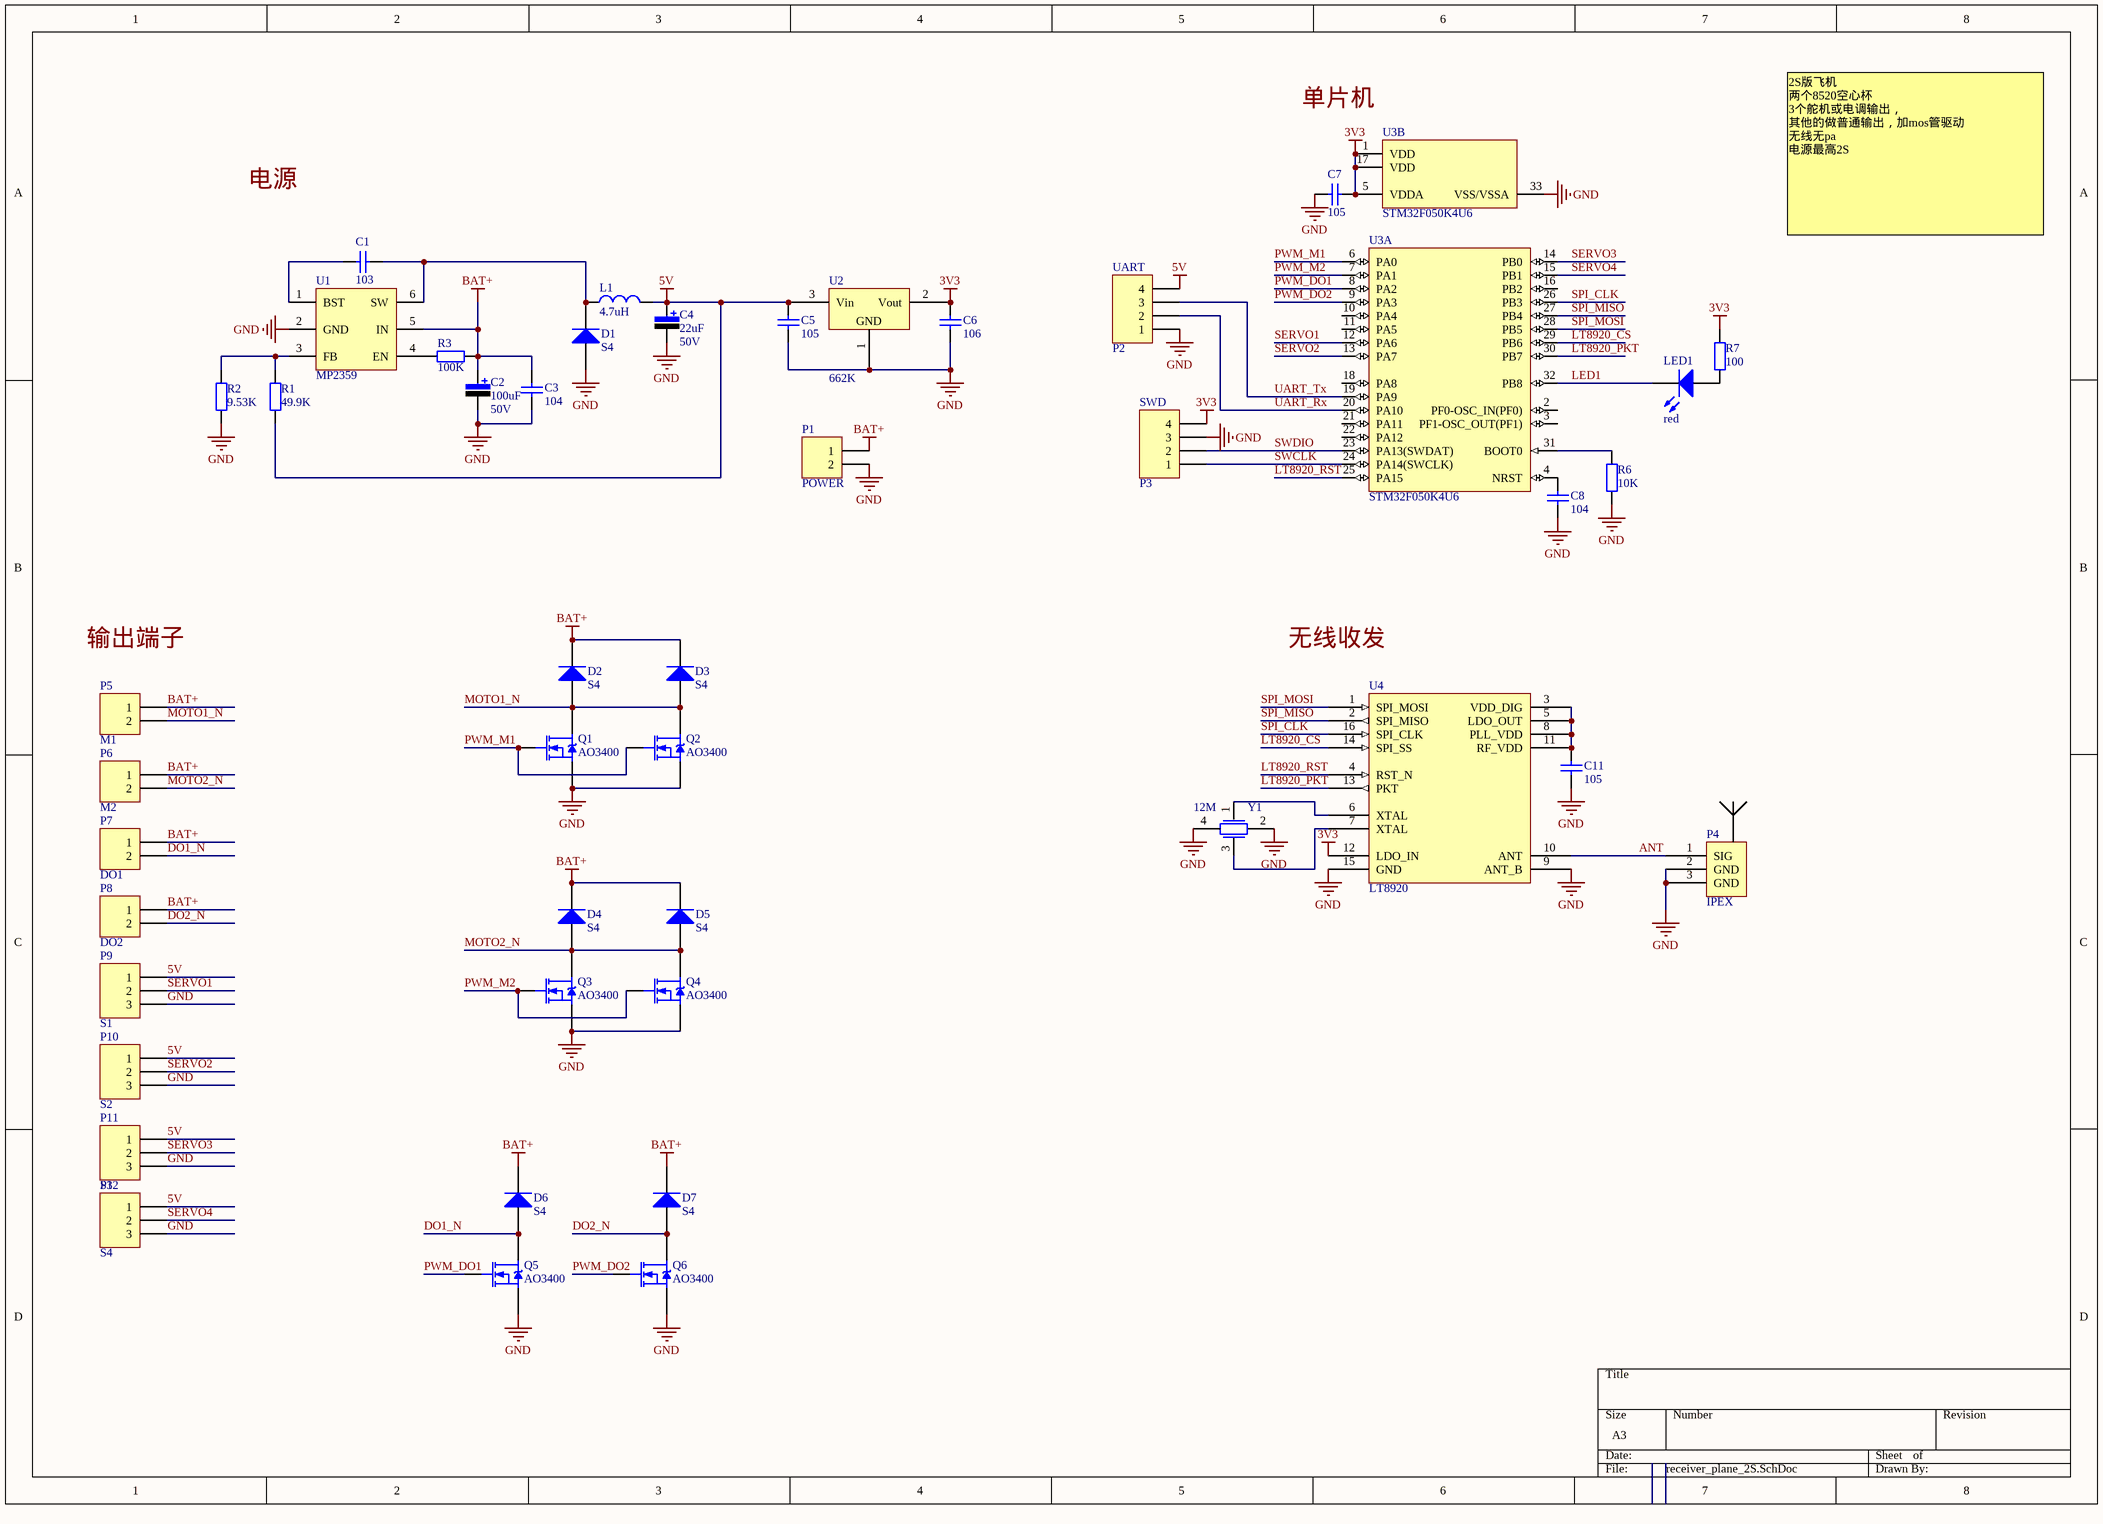
[diagram p4: receiver_plane_2S.SchDoc]

### Parts
(Parts that share a designator on the sheet are numbered #1, #2 ... from top to bottom, then left to right.)
C1#5  103  [0805-2]
C2#6  value 100uF  Vol: 50V  [C-RB-S6]  (hidden comment: Cap Pol)
C3#3  104  [0805-2]
C4#4  value 22uF  Vol: 50V  [C-RB-S6]  (hidden comment: Cap Pol)
C5#4  value 105  [0805-2]  (hidden comment: Cap)
C6#3  value 106  [0805-2]  (hidden comment: Cap)
C7#3  value 105  [0805-2]  (hidden comment: Cap)
C8#3  value 104  [0805-2]  (hidden comment: Cap)
C11#1  value 105  [0805-2]  (hidden comment: Cap)
D1#3  Type: S4  [SOD523]  (hidden comment: 1N5819)
D2#3  Type: S4  [SOD523]  (hidden comment: 1N5819)
D3#3  Type: S4  [SOD523]  (hidden comment: 1N5819)
D4#3  Type: S4  [SOD523]  (hidden comment: 1N5819)
D5#2  Type: S4  [SOD523]  (hidden comment: 1N5819)
D6#2  Type: S4  [SOD523]  (hidden comment: 1N5819)
D7  Type: S4  [SOD523]  (hidden comment: 1N5819)
L1#1  value 4.7uH  [l-SMD-4]  (hidden comment: Inductor)
LED1#1  red  [0603-1]
P1#2  POWER  [HDR2X1_A]
P2#3  UART  [HDR4*1*1.27]
P3#3  SWD  [HDR4*1*1.27]
P4#2  IPEX  [U.FL-R-SMT]
P5#2  M1  [HDR2X1_A]
P6#2  M2  [HDR2X1_A]
P7#2  DO1  [HDR2X1_A]
P8  DO2  [HDR2X1_A]
P9  S1  [HDR3X1_A]
P10  S2  [HDR3X1_A]
P11  S3  [HDR3X1_A]
P12  S4  [HDR3X1_A]
Q1#1  AO3400  [SOT-23-3L]
Q2#1  AO3400  [SOT-23-3L]
Q3#1  AO3400  [SOT-23-3L]
Q4#1  AO3400  [SOT-23-3L]
Q5#1  AO3400  [SOT-23-3L]
Q6  AO3400  [SOT-23-3L]
R1#2  value 49.9K  [0805-2]  (hidden comment: Res1)
R2#3  value 9.53K  [0805-2]  (hidden comment: Res1)
R3#3  value 100K  [0805-2]  (hidden comment: Res1)
R6#3  value 10K  [0805-2]  (hidden comment: Res1)
R7#3  value 100  [0805-2]  (hidden comment: Res1)
U1#4  MP2359  [TSOT23-6]
U2#5  662K  [SOT-23]
U3#3  STM32F050K4U6  [STM-UFQFPN32_N]  (parts A,B of 2)
U4#3  LT8920  [SSOP-16 LT8920]
Y1#5  12M  [XTAL_3225]

### Nets
3V3: C6#3.1 C7#3.2 P3#3.4 R7#3.2 U2#5.2(Vout) U3#3.1(VDD) U3#3.5(VDDA) U3#3.17(VDD) U4#3.12(LDO_IN)
5V: C4#4.1 C5#4.1 L1#1.2 P2#3.4 P9.1 P10.1 P11.1 P12.1 R1#2.1 U2#5.3(Vin)
BAT+: C2#6.1 C3#3.2 D2#3.2(K) D3#3.2(K) D4#3.2(K) D5#2.2(K) D6#2.2(K) D7.2(K) P1#2.1 P5#2.1 P6#2.1 P7#2.1 P8.1 R3#3.1 U1#4.5(IN)
GND: C2#6.2 C3#3.1 C4#4.2 C5#4.2 C6#3.2 C7#3.1 C8#3.2 C11#1.1 D1#3.1(A) P1#2.2 P2#3.1 P3#3.3 P4#2.2(GND) P4#2.3(GND) P9.3 P10.3 P11.3 P12.3 Q1#1.S Q2#1.S Q3#1.S Q4#1.S Q5#1.S Q6.S R2#3.2 R6#3.2 U1#4.2(GND) U2#5.1(Vss) U3#3.33(VSS/VSSA) U4#3.9(ANT_B) U4#3.15(GND) Y1#5.2 Y1#5.4
ANT: P4#2.1(SIG) U4#3.10(ANT)
DO1_N: D6#2.1(A) P7#2.2 Q5#1.D
DO2_N: D7.1(A) P8.2 Q6.D
LED1: LED1#1.2(K) U3#3.32(PB8)
LT8920_CS: U3#3.29(PB6) U4#3.14(SPI_SS)
LT8920_PKT: U3#3.30(PB7) U4#3.13(PKT)
LT8920_RST: U3#3.25(PA15) U4#3.4(RST_N)
MOTO1_N: D2#3.1(A) D3#3.1(A) P5#2.2 Q1#1.D Q2#1.D
MOTO2_N: D4#3.1(A) D5#2.1(A) P6#2.2 Q3#1.D Q4#1.D
PWM_DO1: Q5#1.G U3#3.8(PA2)
PWM_DO2: Q6.G U3#3.9(PA3)
PWM_M1: Q1#1.G Q2#1.G U3#3.6(PA0)
PWM_M2: Q3#1.G Q4#1.G U3#3.7(PA1)
SERVO1: P9.2 U3#3.12(PA6)
SERVO2: P10.2 U3#3.13(PA7)
SERVO3: P11.2 U3#3.14(PB0)
SERVO4: P12.2 U3#3.15(PB1)
SPI_CLK: U3#3.26(PB3) U4#3.16(SPI_CLK)
SPI_MISO: U3#3.27(PB4) U4#3.2(SPI_MISO)
SPI_MOSI: U3#3.28(PB5) U4#3.1(SPI_MOSI)
SWCLK: P3#3.1 U3#3.24(PA14(SWCLK))
SWDIO: P3#3.2 U3#3.23(PA13(SWDAT))
UART_Rx: P2#3.2 U3#3.20(PA10)
UART_Tx: P2#3.3 U3#3.19(PA9)
NetC1#5_1: C1#5.1 U1#4.1(BST)
NetC1#5_2: C1#5.2 D1#3.2(K) L1#1.1 U1#4.6(SW)
NetC8#3_1: C8#3.1 U3#3.4(NRST)
NetC11#1_2: C11#1.2 U4#3.3(VDD_DIG) U4#3.5(LDO_OUT) U4#3.8(PLL_VDD) U4#3.11(RF_VDD)
NetLED1#1_1: LED1#1.1(A) R7#3.1
NetR1#2_2: R1#2.2 R2#3.1 U1#4.3(FB)
NetR3#3_2: R3#3.2 U1#4.4(EN)
NetR6#3_1: R6#3.1 U3#3.31(BOOT0)
NetU4#3_6: U4#3.6(XTAL) Y1#5.1
NetU4#3_7: U4#3.7(XTAL) Y1#5.3

Not connected (* = marked no-connect by the designer): U3#3 2(PF0-OSC_IN(PF0)) 3(PF1-OSC_OUT(PF1)) 10(PA4) 11(PA5) 16(PB2) 18(PA8) 21(PA11) 22(PA12)

### Notes on the sheet
- 单片机
- 电源
- 2S版飞机
  两个8520空心杯
  3个舵机或电调输出，
  其他的做普通输出，加mos管驱动
  无线无pa
  电源最高2S
- 输出端子
- 无线收发
- (in symbol 662K) GND

### Library data of the parts
C1#5 = Cap Semi: Capacitor (Semiconductor SIM Model); Published: 8-Jun-2000; LatestRevisionDate: 29-May-2009; LatestRevisionNote: IPC-7351 Footprint Added.; PackageReference: C1206; Publisher: Altium Limited; PackageDescription: Chip Capacitor; Value: 103
C2#6 C4#4 = Cap Pol: 极性电解电容; Published: 8-Jun-2000; LatestRevisionDate: 17-Jul-2002; LatestRevisionNote: Re-released for DXP Platform.; PackageReference: RB7.6-15; Publisher: Altium Limited
C3#3 = Cap Semi: Capacitor (Semiconductor SIM Model); Value: 106; Published: 8-Jun-2000; LatestRevisionDate: 29-May-2009; LatestRevisionNote: IPC-7351 Footprint Added.; PackageReference: C1206; Publisher: Altium Limited; PackageDescription: Chip Capacitor
C5#4 C6#3 C7#3 C8#3 C11#1 = Cap: 无极性电容; Published: 8-Jun-2000; LatestRevisionDate: 17-Jul-2002; LatestRevisionNote: Re-released for DXP Platform.; PackageReference: RAD-0.3; Publisher: Altium Limited
D1#3 D2#3 D3#3 D4#3 D5#2 D6#2 D7 = Diode: 二极管; Published: 8-Jun-2000; LatestRevisionDate: 17-Jul-2002; LatestRevisionNote: Re-released for DXP Platform.; PackageDocument: Sep-1996; PackageReference: SMC; Publisher: Altium Limited; Code_JEDEC: DO-214-AB
L1#1 = Inductor: 电感; Code_IEC: 1005; Published: 8-Jun-2000; LatestRevisionDate: 17-Jul-2002; LatestRevisionNote: Re-released for DXP Platform.; PackageReference: 0402-A; Publisher: Altium Limited; Code_JEITA: 0402
LED1#1 = LED3: Typical BLUE SiC LED; Published: 8-Jun-2000; LatestRevisionDate: 17-Dec-2003; LatestRevisionNote: PCB Footprint replaced.; DatasheetVersion: 16-Apr-2002; PackageVersion: 16-Apr-2002; PackageReference: 3.5X2.8X1.9; Publisher: Altium Limited; PackageDescription: SM LED; 2 C-Bend Leads; Body 3.5 x 2.8 x 1.9 mm, inc leads (LxWxH typ)
P1#2 P5#2 P6#2 P7#2 P8 = Header 2: 接插件; LatestRevisionDate: 17-Jul-2002; LatestRevisionNote: Re-released for DXP Platform.; Publisher: Altium Limited
P2#3 P3#3 = Header 4: 接插件; LatestRevisionDate: 17-Jul-2002; LatestRevisionNote: Re-released for DXP Platform.; Publisher: Altium Limited
P4#2 = IPEX: U.FL-R-SMT
P9-P12 = Header 3: 接插件; LatestRevisionDate: 17-Jul-2002; LatestRevisionNote: Re-released for DXP Platform.; Publisher: Altium Limited
Q1#1 Q2#1 Q3#1 Q4#1 Q5#1 Q6 = MOSFET-N: N-Channel MOSFET; PackageDocument: 1995/1996; Published: 8-Jun-2000; LatestRevisionDate: 17-Jul-2002; LatestRevisionNote: Re-released for DXP Platform.; PackageReference: E3; Publisher: Altium Limited
R1#2 R2#3 R3#3 R6#3 R7#3 = Res1: 贴片电阻; Published: 8-Jun-2000; LatestRevisionDate: 17-Jul-2002; LatestRevisionNote: Re-released for DXP Platform.; PackageReference: AXIAL-0.4; Publisher: Altium Limited
U3#3 = STM32F050K4U6: as U?#4 on sheet receiver_plane; DatasheetVersion: Rev. 1; PackageVersion: Rev. 3, 07/2012; PackageReference: UFQFPN32; PackageDescription: 32-Pin Ultra Thin Fine Pitch Quad Flat No-Lead, 5 x 5 x 0.6 mm Body, 0.5 mm Pitch, Exposed Pad; Supplier 1: Digi-Key; Supplier Part Number 1: 497-13621-ND; Supplier 2: Farnell; Supplier Part Number 2: 2333139; Supplier 3: Newark; Supplier Part Number 3: 99W9752; Supplier 4: Newark; Supplier Part Number 4: 48W6864; Supplier 5: Mouser; Supplier Part Number 5: 511-STM32F050K4U6; Core: ARM Cortex-M0; Packing: Tray; Mounting Technology: Surface Mount; PartNumber: STM32F050K4U6; ComponentLink1Description: Manufacturer URL; ComponentLink1URL: http://www.st.com/web/en/home.html; ComponentLink2Description: Datasheet; ComponentLink2URL: http://www.st.com/st-web-ui/static/active/en/resource/technical/document/datasheet/DM00065136.pdf; ComponentLink3Description: Package Specification; ComponentLink3URL: http://www.st.com/st-web-ui/static/active/en/resource/technical/document/datasheet/DM00039193.pdf
Y1#5 = XTAL-4PIN: 贴片晶振

## Sheet receiver_car_2s.SchDoc
size A3
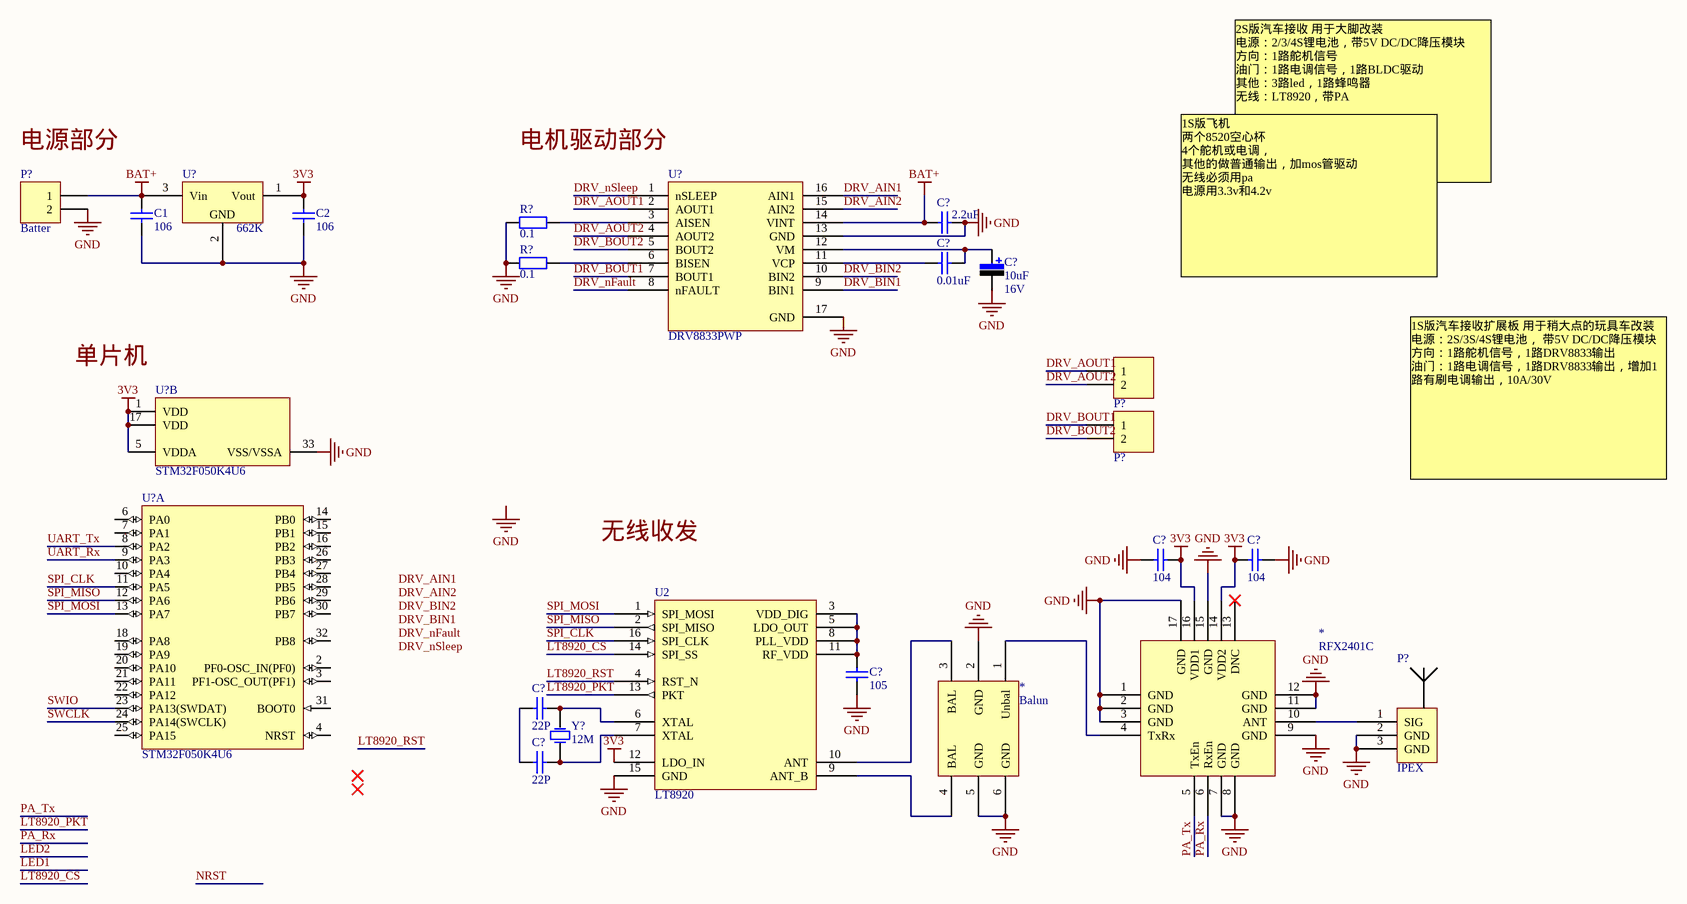
[diagram p5: receiver_car_2s.SchDoc]

### Parts
(Parts that share a designator on the sheet are numbered #1, #2 ... from top to bottom, then left to right.)
*#5  RFX2401C  [QFN-16 - duplicate]
*#6  Balun  [Balun]
C1#6  106  [0805]
C2#7  106  [0805]
C?#13  value 2.2uF  [0805-2]  (hidden comment: Cap)
C?#14  value 0.01uF  [0805-2]  (hidden comment: Cap)
C?#15  value 10uF  Vol: 16V  [C-RB-8]  (hidden comment: Cap Pol)
C?#16  value 104  [0805-2]  (hidden comment: Cap)
C?#17  value 104  [0805-2]  (hidden comment: Cap)
C?#18  value 105  [0805-2]  (hidden comment: Cap)
C?#19  value 22P  [0805-2]  (hidden comment: Cap)
C?#20  value 22P  [0805-2]  (hidden comment: Cap)
P?#9  Batter  [HDR1X2]
P?#10  Header 2  [HDR2X1_A]  (value not drawn)
P?#11  Header 2  [HDR2X1_A]  (value not drawn)
P?#12  IPEX  [U.FL-R-SMT]
R?#7  value 0.1  [0603-1]  (hidden comment: Res1)
R?#8  value 0.1  [0603-1]  (hidden comment: Res1)
U2#6  LT8920
U?#6  DRV8833PWP  [HTSSOP-16 DRV8833]
U?#7  662K  [SOT-23]
U?#8  STM32F050K4U6  [STM-UFQFPN32_N]  (part B of 2)
U?#9  STM32F050K4U6  [STM-UFQFPN32_N]  (part A of 2)
Y?  value 12M  [X-HC49U]  (hidden comment: XTAL)

### Nets
3V3: *#5.14(VDD2) *#5.16(VDD1) C2#7.2 C?#16.1 C?#17.2 U2#6.12(LDO_IN) U?#7.1(Vout) U?#8.1(VDD) U?#8.5(VDDA) U?#8.17(VDD)
BAT+: C1#6.2 C?#13.2 P?#9.1 U?#6.14(VINT) U?#7.3(Vin)
GND: *#5.1(GND) *#5.2(GND) *#5.3(GND) *#5.7(GND) *#5.8(GND) *#5.9(GND) *#5.11(GND) *#5.12(GND) *#5.15(GND) *#5.17(GND) *#6.2(GND) *#6.5(GND) *#6.6(GND) C1#6.1 C2#7.1 C?#13.1 C?#15.2 C?#16.2 C?#17.1 C?#18.1 P?#9.2 P?#12.2(GND) P?#12.3(GND) R?#7.2 R?#8.2 U2#6.15(GND) U?#6.13(GND) U?#6.17(GND) U?#7.2(Vss) U?#8.33(VSS/VSSA)
DRV_AIN1: U?#6.16(AIN1)
DRV_AIN2: U?#6.15(AIN2)
DRV_AOUT1: P?#10.1 U?#6.2(AOUT1)
DRV_AOUT2: P?#10.2 U?#6.4(AOUT2)
DRV_BIN1: U?#6.9(BIN1)
DRV_BIN2: U?#6.10(BIN2)
DRV_BOUT1: P?#11.1 U?#6.7(BOUT1)
DRV_BOUT2: P?#11.2 U?#6.5(BOUT2)
DRV_nFault: U?#6.8(nFAULT)
DRV_nSleep: U?#6.1(nSLEEP)
LT8920_CS: U2#6.14(SPI_SS)
LT8920_PKT: U2#6.13(PKT)
LT8920_RST: U2#6.4(RST_N)
PA_Rx: *#5.6(RxEn)
PA_Tx: *#5.5(TxEn)
SPI_CLK: U2#6.16(SPI_CLK) U?#9.11(PA5)
SPI_MISO: U2#6.2(SPI_MISO) U?#9.12(PA6)
SPI_MOSI: U2#6.1(SPI_MOSI) U?#9.13(PA7)
SWCLK: U?#9.24(PA14(SWCLK))
SWIO: U?#9.23(PA13(SWDAT))
UART_Rx: U?#9.9(PA3)
UART_Tx: U?#9.8(PA2)
Net*#5_4: *#5.4(TxRx) *#6.1(Unbal)
Net*#5_10: *#5.10(ANT) P?#12.1(SIG)
Net*#6_3: *#6.3(BAL) U2#6.10(ANT)
Net*#6_4: *#6.4(BAL) U2#6.9(ANT_B)
NetC?#14_1: C?#14.1 C?#15.1 U?#6.12(VM)
NetC?#14_2: C?#14.2 U?#6.11(VCP)
NetC?#18_2: C?#18.2 U2#6.3(VDD_DIG) U2#6.5(LDO_OUT) U2#6.8(PLL_VDD) U2#6.11(RF_VDD)
NetC?#19_1: C?#19.1 C?#20.1
NetC?#19_2: C?#19.2 U2#6.6(XTAL) Y?.2(OSC2)
NetC?#20_2: C?#20.2 U2#6.7(XTAL) Y?.1(OSC1)
NetR?#7_1: R?#7.1 U?#6.3(AISEN)
NetR?#8_1: R?#8.1 U?#6.6(BISEN)

Not connected (* = marked no-connect by the designer): *#5 13(DNC)*; U?#9 2(PF0-OSC_IN(PF0)) 3(PF1-OSC_OUT(PF1)) 4(NRST) 6(PA0) 7(PA1) 10(PA4) 14(PB0) 15(PB1) 16(PB2) 18(PA8) 19(PA9) 20(PA10) 21(PA11) 22(PA12) 25(PA15) 26(PB3) 27(PB4) 28(PB5) 29(PB6) 30(PB7) 31(BOOT0) 32(PB8)

### Notes on the sheet
- (near P?#9) 电源部分
- 电机驱动部分
- 2S版汽车接收 用于大脚改装
  电源：2/3/4S锂电池，带5V DC/DC降压模块
  方向：1路舵机信号
  油门：1路电调信号，1路BLDC驱动
  其他：3路led，1路蜂鸣器
  无线：LT8920，带PA
- 1S版飞机
  两个8520空心杯
  4个舵机或电调，
  其他的做普通输出，加mos管驱动
  无线必须用pa
  电源用3.3v和4.2v
- 单片机
- 1S版汽车接收扩展板 用于稍大点的玩具车改装
  电源：2S/3S/4S锂电池， 带5V DC/DC降压模块
  方向：1路舵机信号，1路DRV8833输出
  油门：1路电调信号，1路DRV8833输出，增加1路有刷电调输出，10A/30V
- 无线收发
- Labels drawn without touching a wire or pin: DRV_AIN1, DRV_AIN2, DRV_BIN1, DRV_BIN2, DRV_nFault, DRV_nSleep, GND
- (in symbol 662K) GND

### Library data of the parts
*#6 = Balun: 2450BM15A0002
C1#6 C2#7 = Cap Semi: Capacitor (Semiconductor SIM Model); Published: 8-Jun-2000; LatestRevisionDate: 29-May-2009; LatestRevisionNote: IPC-7351 Footprint Added.; PackageReference: C1206; Publisher: Altium Limited; PackageDescription: Chip Capacitor; Value: 106
C?#13 C?#14 C?#16-C?#20 = Cap: 无极性电容; Published: 8-Jun-2000; LatestRevisionDate: 17-Jul-2002; LatestRevisionNote: Re-released for DXP Platform.; PackageReference: RAD-0.3; Publisher: Altium Limited
C?#15 = Cap Pol: 极性电解电容; Published: 8-Jun-2000; LatestRevisionDate: 17-Jul-2002; LatestRevisionNote: Re-released for DXP Platform.; PackageReference: RB7.6-15; Publisher: Altium Limited
P?#9 = Header 2: Header, 2-Pin; LatestRevisionDate: 17-Jul-2002; LatestRevisionNote: Re-released for DXP Platform.; Publisher: Altium Limited
P?#10 P?#11 = Header 2: 接插件; LatestRevisionDate: 17-Jul-2002; LatestRevisionNote: Re-released for DXP Platform.; Publisher: Altium Limited
P?#12 = IPEX: U.FL-R-SMT
R?#7 R?#8 = Res1: 贴片电阻; Published: 8-Jun-2000; LatestRevisionDate: 17-Jul-2002; LatestRevisionNote: Re-released for DXP Platform.; PackageReference: AXIAL-0.4; Publisher: Altium Limited
U?#6 = DRV8833PWP: DRV8833_HTSSOP封装
U?#8 U?#9 = STM32F050K4U6: as U?#4 on sheet receiver_plane; DatasheetVersion: Rev. 1; PackageVersion: Rev. 3, 07/2012; PackageReference: UFQFPN32; PackageDescription: 32-Pin Ultra Thin Fine Pitch Quad Flat No-Lead, 5 x 5 x 0.6 mm Body, 0.5 mm Pitch, Exposed Pad; Supplier 1: Digi-Key; Supplier Part Number 1: 497-13621-ND; Supplier 2: Farnell; Supplier Part Number 2: 2333139; Supplier 3: Newark; Supplier Part Number 3: 99W9752; Supplier 4: Newark; Supplier Part Number 4: 48W6864; Supplier 5: Mouser; Supplier Part Number 5: 511-STM32F050K4U6; Core: ARM Cortex-M0; Packing: Tray; Mounting Technology: Surface Mount; PartNumber: STM32F050K4U6; ComponentLink1Description: Manufacturer URL; ComponentLink1URL: http://www.st.com/web/en/home.html; ComponentLink2Description: Datasheet; ComponentLink2URL: http://www.st.com/st-web-ui/static/active/en/resource/technical/document/datasheet/DM00065136.pdf; ComponentLink3Description: Package Specification; ComponentLink3URL: http://www.st.com/st-web-ui/static/active/en/resource/technical/document/datasheet/DM00039193.pdf
Y? = XTAL: 晶振; Published: 8-Jun-2000; LatestRevisionDate: 17-Jul-2002; LatestRevisionNote: Re-released for DXP Platform.; PackageReference: R38; Publisher: Altium Limited

## Sheet receiver_car_1s.SchDoc
size A3
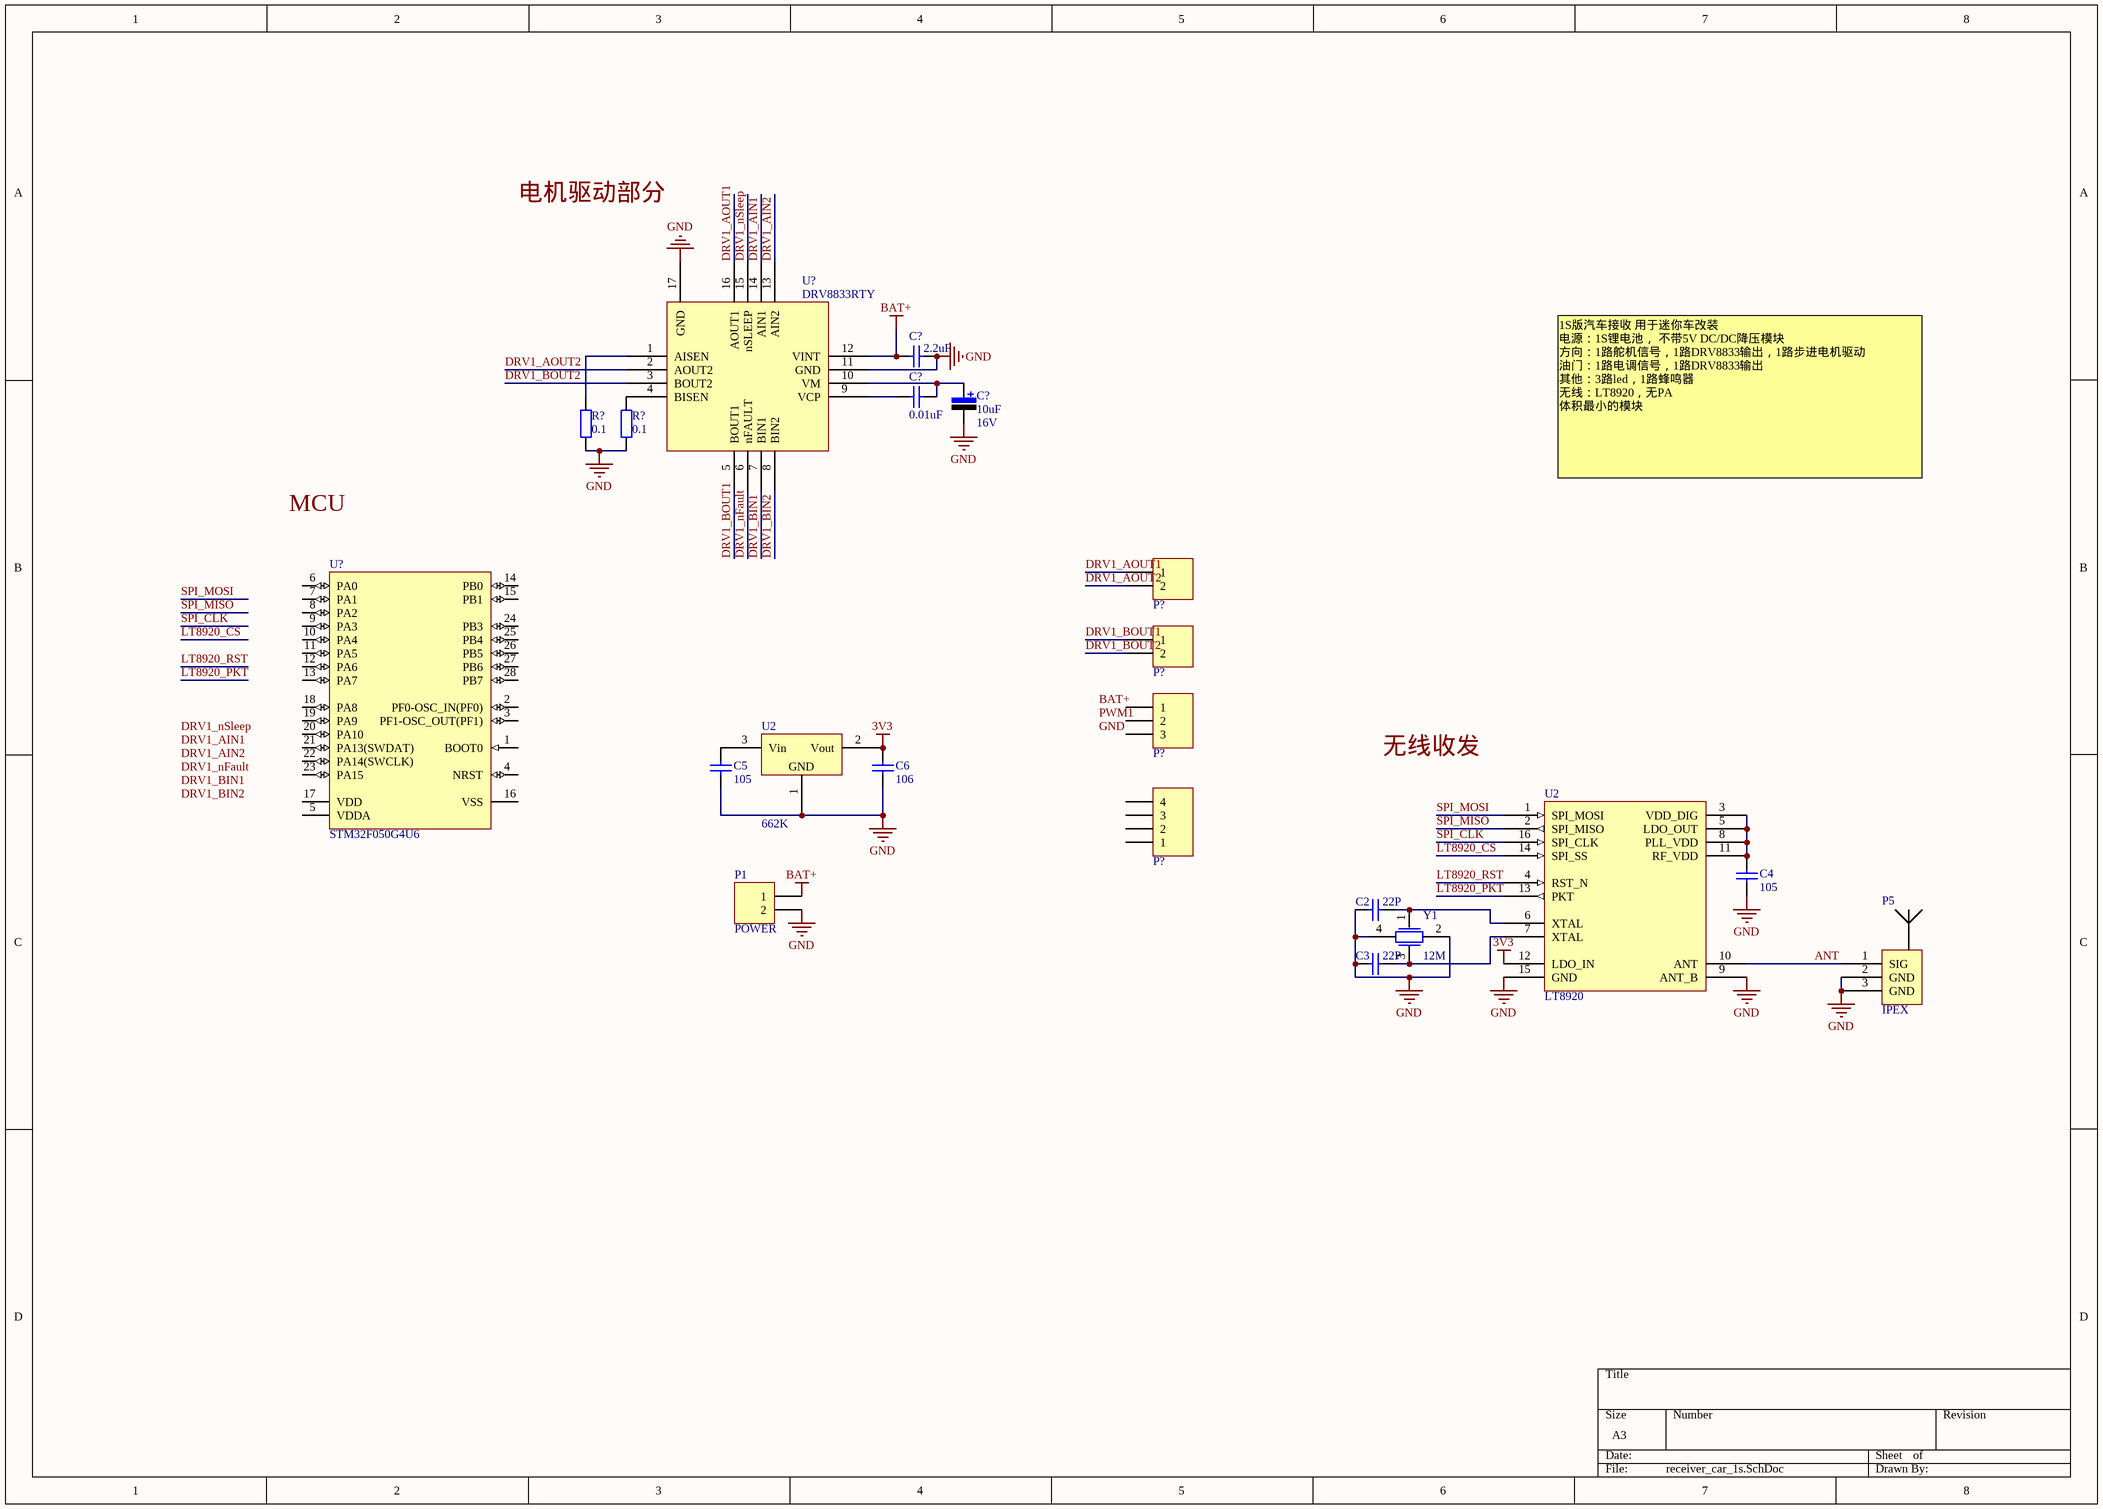
[diagram p6: receiver_car_1s.SchDoc]

### Parts
(Parts that share a designator on the sheet are numbered #1, #2 ... from top to bottom, then left to right.)
C2#8  value 22P  [0805-2]  (hidden comment: Cap)
C3#4  value 22P  [0805-2]  (hidden comment: Cap)
C4#5  value 105  [0805-2]  (hidden comment: Cap)
C5#5  value 105  [0805-2]  (hidden comment: Cap)
C6#4  value 106  [0805-2]  (hidden comment: Cap)
C?#21  value 2.2uF  [0805-2]  (hidden comment: Cap)
C?#22  value 0.01uF  [0805-2]  (hidden comment: Cap)
C?#23  value 10uF  Vol: 16V  [C-RB-8]  (hidden comment: Cap Pol)
P1#3  POWER  [HDR2X1_A]
P5#3  IPEX  [U.FL-R-SMT]
P?#13  Header 2  [HDR2X1_A]  (value not drawn)
P?#14  Header 2  [HDR2X1_A]  (value not drawn)
P?#15  Header 3  [HDR3X1_A]  (value not drawn)
P?#16  Header 4  [HDR4X1X1.27]  (value not drawn)
R?#9  value 0.1  [0603-1]  (hidden comment: Res1)
R?#10  value 0.1  [0603-1]  (hidden comment: Res1)
U2#7  662K  [SOT-23]
U2#8  LT8920  [SSOP-16 LT8920]
U?#10  DRV8833RTY  [QFN-16 - duplicate1]
U?#11  STM32F050G4U6  [STM-UFQFPN28_V]
Y1#6  12M  [XTAL_3225]

### Nets
3V3: C6#4.1 U2#7.2(Vout) U2#8.12(LDO_IN)
BAT+: C?#21.2 P1#3.1 U?#10.12(VINT)
GND: C2#8.1 C3#4.1 C4#5.1 C5#5.2 C6#4.2 C?#21.1 C?#23.2 P1#3.2 P5#3.2(GND) P5#3.3(GND) R?#9.2 R?#10.2 U2#7.1(Vss) U2#8.9(ANT_B) U2#8.15(GND) U?#10.11(GND) U?#10.17(GND) Y1#6.2 Y1#6.4
ANT: P5#3.1(SIG) U2#8.10(ANT)
DRV1_AIN1: U?#10.14(AIN1)
DRV1_AIN2: U?#10.13(AIN2)
DRV1_AOUT1: P?#13.1 U?#10.16(AOUT1)
DRV1_AOUT2: P?#13.2 U?#10.2(AOUT2)
DRV1_BIN1: U?#10.7(BIN1)
DRV1_BIN2: U?#10.8(BIN2)
DRV1_BOUT1: P?#14.1 U?#10.5(BOUT1)
DRV1_BOUT2: P?#14.2 U?#10.3(BOUT2)
DRV1_nFault: U?#10.6(nFAULT)
DRV1_nSleep: U?#10.15(nSLEEP)
LT8920_CS: U2#8.14(SPI_SS)
LT8920_PKT: U2#8.13(PKT)
LT8920_RST: U2#8.4(RST_N)
SPI_CLK: U2#8.16(SPI_CLK)
SPI_MISO: U2#8.2(SPI_MISO)
SPI_MOSI: U2#8.1(SPI_MOSI)
NetC2#8_2: C2#8.2 U2#8.6(XTAL) Y1#6.1
NetC3#4_2: C3#4.2 U2#8.7(XTAL) Y1#6.3
NetC4#5_2: C4#5.2 U2#8.3(VDD_DIG) U2#8.5(LDO_OUT) U2#8.8(PLL_VDD) U2#8.11(RF_VDD)
NetC5#5_1: C5#5.1 U2#7.3(Vin)
NetC?#22_1: C?#22.1 C?#23.1 U?#10.10(VM)
NetC?#22_2: C?#22.2 U?#10.9(VCP)
NetR?#9_1: R?#9.1 U?#10.1(AISEN)
NetR?#10_1: R?#10.1 U?#10.4(BISEN)

Not connected (* = marked no-connect by the designer): P?#15 1 2 3; P?#16 1 2 3 4; U?#11 1(BOOT0) 2(PF0-OSC_IN(PF0)) 3(PF1-OSC_OUT(PF1)) 4(NRST) 5(VDDA) 6(PA0) 7(PA1) 8(PA2) 9(PA3) 10(PA4) 11(PA5) 12(PA6) 13(PA7) 14(PB0) 15(PB1) 16(VSS) 17(VDD) 18(PA8) 19(PA9) 20(PA10) 21(PA13(SWDAT)) 22(PA14(SWCLK)) 23(PA15) 24(PB3) 25(PB4) 26(PB5) 27(PB6) 28(PB7)

### Notes on the sheet
- 电机驱动部分
- MCU
- 1S版汽车接收 用于迷你车改装
  电源：1S锂电池， 不带5V DC/DC降压模块
  方向：1路舵机信号，1路DRV8833输出，1路步进电机驱动
  油门：1路电调信号，1路DRV8833输出
  其他：3路led，1路蜂鸣器
  无线：LT8920，无PA
  体积最小的模块
- 无线收发
- Labels drawn without touching a wire or pin: BAT+, DRV1_AIN1, DRV1_AIN2, DRV1_BIN1, DRV1_BIN2, DRV1_nFault, DRV1_nSleep, GND, PWM1
- (in symbol 662K) GND

### Library data of the parts
C2#8 C3#4 C4#5 C5#5 C6#4 C?#21 C?#22 = Cap: 无极性电容; Published: 8-Jun-2000; LatestRevisionDate: 17-Jul-2002; LatestRevisionNote: Re-released for DXP Platform.; PackageReference: RAD-0.3; Publisher: Altium Limited
C?#23 = Cap Pol: 极性电解电容; Published: 8-Jun-2000; LatestRevisionDate: 17-Jul-2002; LatestRevisionNote: Re-released for DXP Platform.; PackageReference: RB7.6-15; Publisher: Altium Limited
P1#3 P?#13 P?#14 = Header 2: 接插件; LatestRevisionDate: 17-Jul-2002; LatestRevisionNote: Re-released for DXP Platform.; Publisher: Altium Limited
P5#3 = IPEX: U.FL-R-SMT
P?#15 = Header 3: 接插件; LatestRevisionDate: 17-Jul-2002; LatestRevisionNote: Re-released for DXP Platform.; Publisher: Altium Limited
P?#16 = Header 4: 接插件; LatestRevisionDate: 17-Jul-2002; LatestRevisionNote: Re-released for DXP Platform.; Publisher: Altium Limited
R?#9 R?#10 = Res1: 贴片电阻; Published: 8-Jun-2000; LatestRevisionDate: 17-Jul-2002; LatestRevisionNote: Re-released for DXP Platform.; PackageReference: AXIAL-0.4; Publisher: Altium Limited
U?#10 = DRV8833RTY: DRV8833_QFN封装
U?#11 = STM32F050G4U6: ARM Cortex-M0 32-bit MCU, 16 KB Flash, 4 KB Internal RAM, 23 I/Os, 28-pin UFQFPN, -40 to 85 degC, Tray; FLASH Size (Prog) (kB): 16; I/Os (High Current): 23; Internal RAM Size (kB): 4; Operating Frequency(F) (Processor speed) (MHz): 48; Supply Voltage(Vcc) min (V): 2; DatasheetVersion: Rev. 1; PackageVersion: Rev. 1, 11/2012; PackageReference: UFQFPN28; PackageDescription: 28-Pin Ultra Thin Fine Pitch Quad Flat No-Lead, 4 x 4 x 0.6 mm Body, 0.5 mm Pitch; Supplier 1: Digi-Key; Supplier Part Number 1: 497-13619-ND; Supplier 2: Farnell; Supplier Part Number 2: 2333137; Supplier 3: Newark; Supplier Part Number 3: 99W9750; Supplier 4: Newark; Supplier Part Number 4: 66W7272; Supplier 5: Mouser; Supplier Part Number 5: 511-STM32F050G4U6; Core: ARM Cortex-M0; Packing: Tray; Mounting Technology: Surface Mount; PartNumber: STM32F050G4U6; ComponentLink1Description: Manufacturer URL; ComponentLink1URL: http://www.st.com/web/en/home.html; ComponentLink2Description: Datasheet; ComponentLink2URL: http://www.st.com/st-web-ui/static/active/en/resource/technical/document/datasheet/DM00065136.pdf; ComponentLink3Description: Package Specification; ComponentLink3URL: http://www.st.com/st-web-ui/static/active/en/resource/technical/document/datasheet/DM00065136.pdf
Y1#6 = XTAL-4PIN: 贴片晶振